# EAGLE design CrackberryPi_1.0.5 (EAGLE 7.2.0)
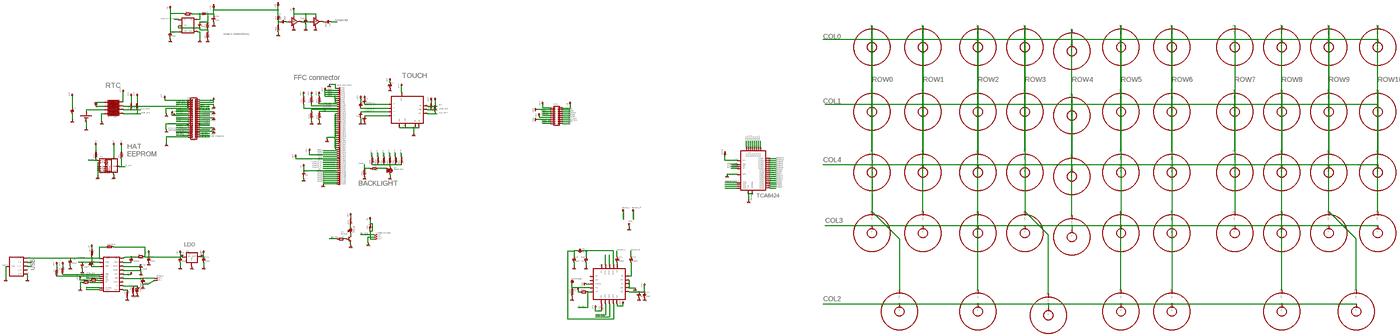
[diagram p0: schematic, sheet 1, overview]
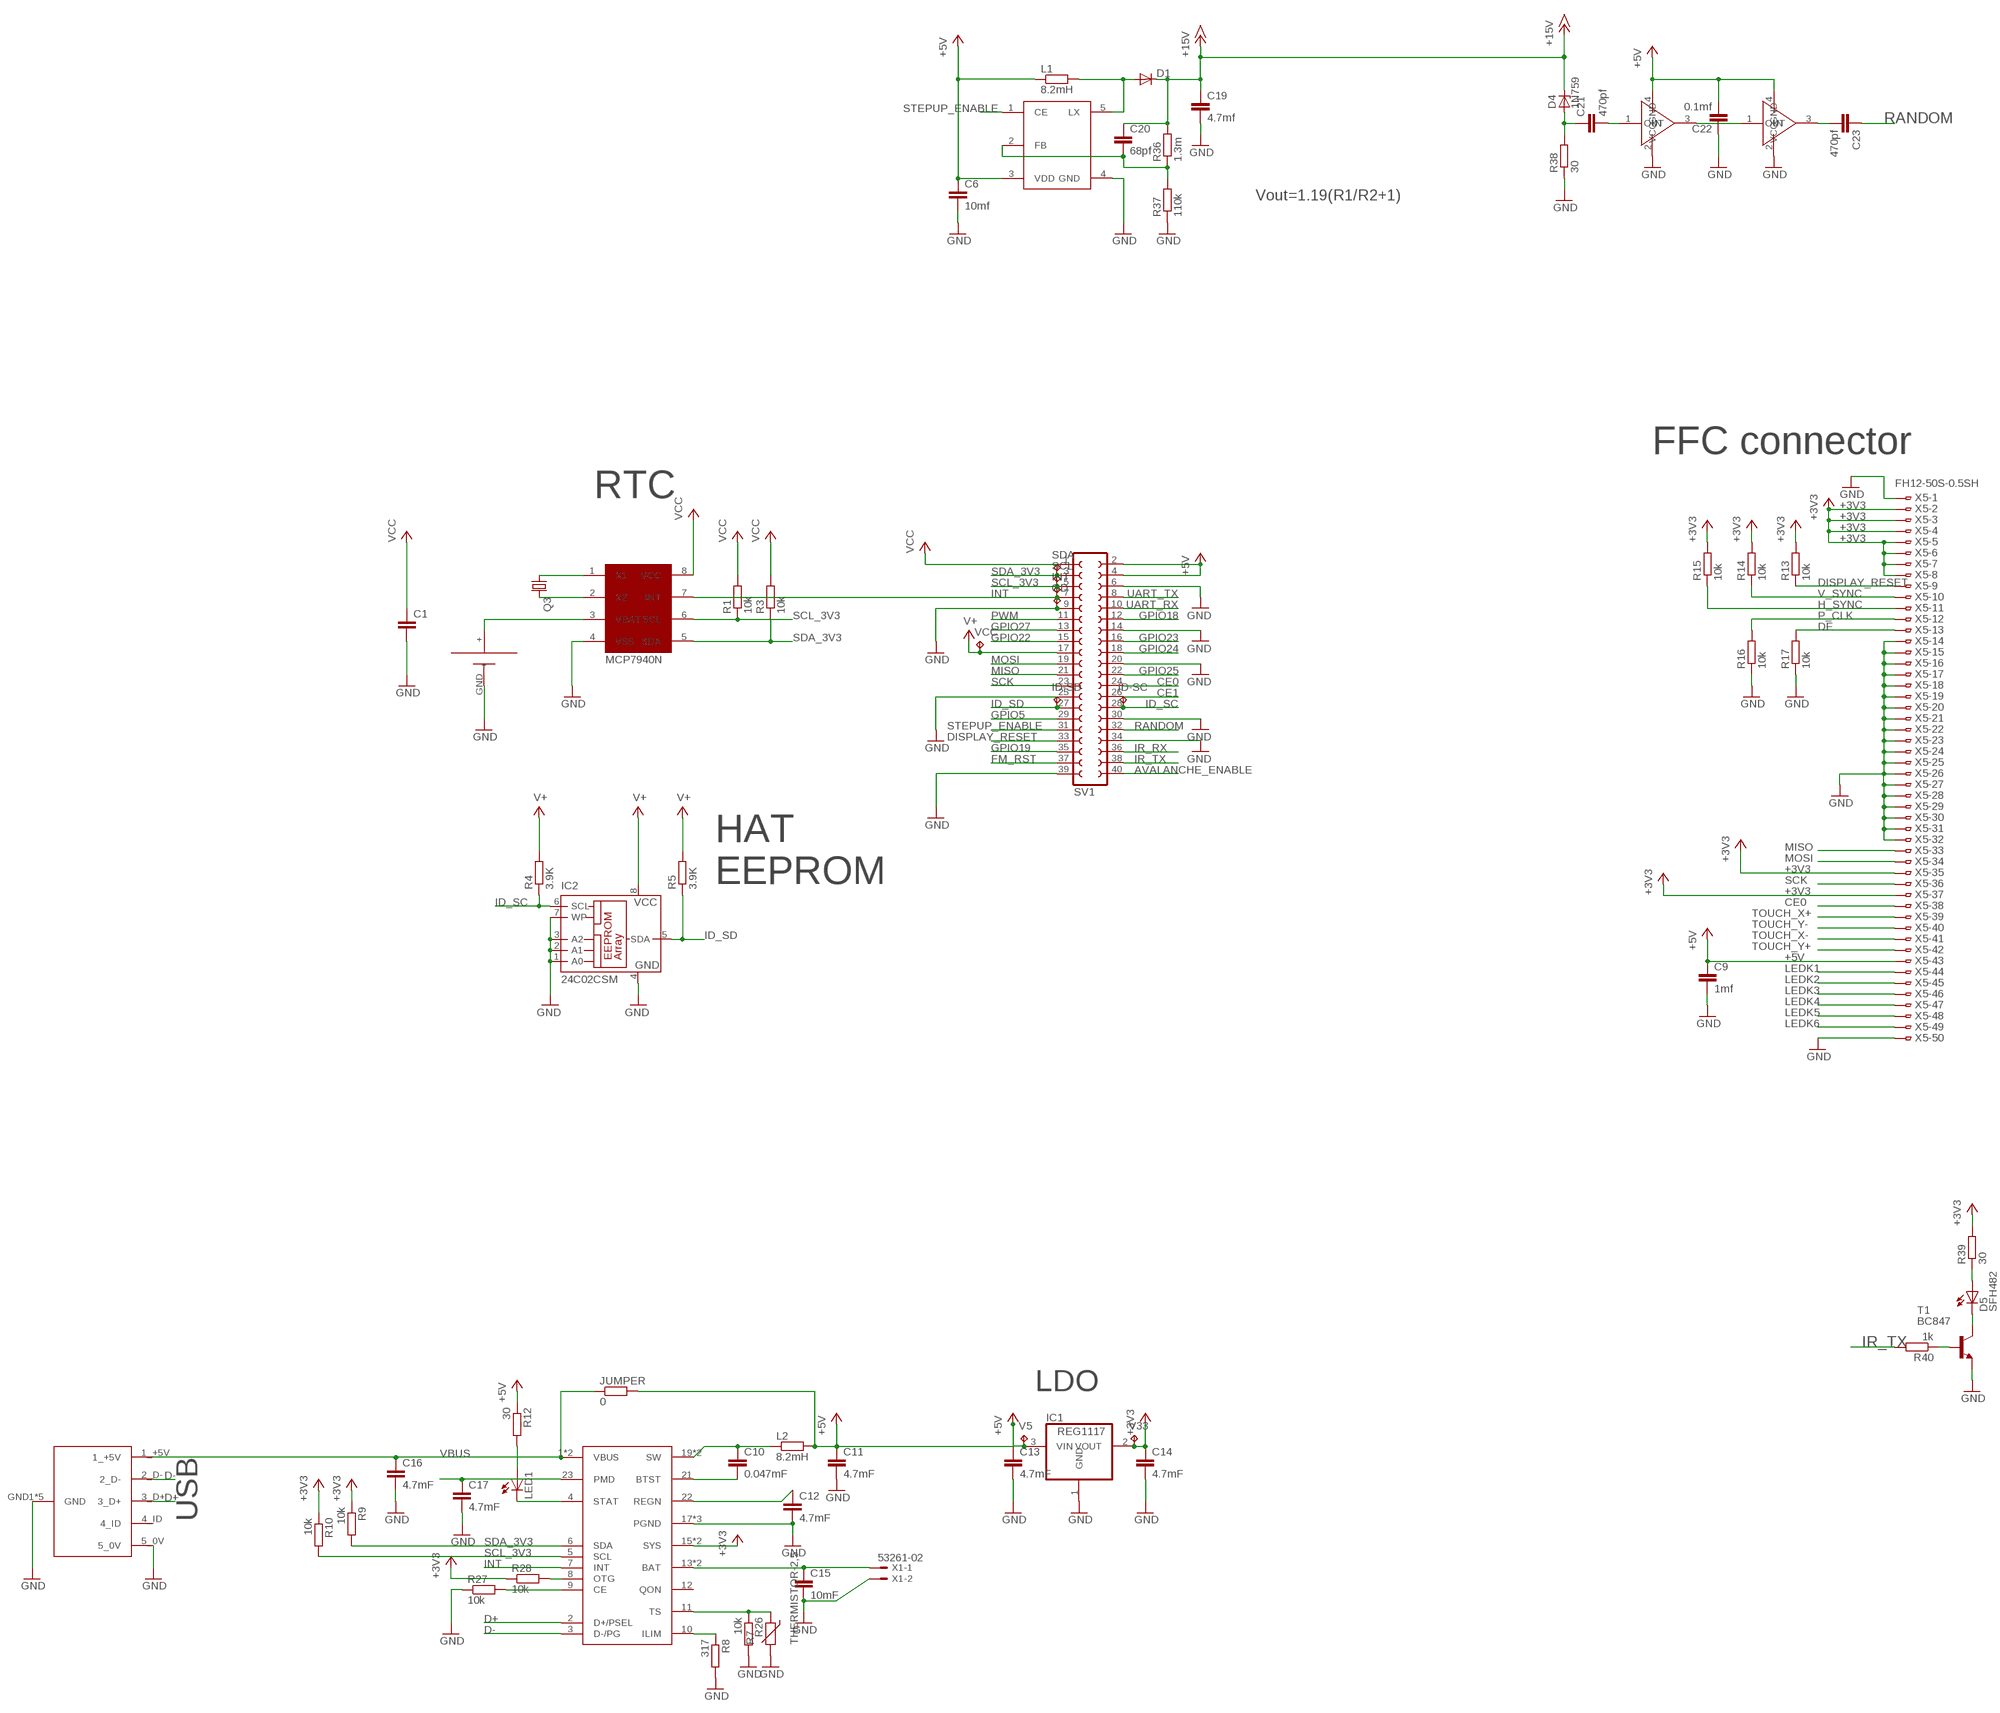
[diagram p1: schematic, sheet 1, part 1 of 4]
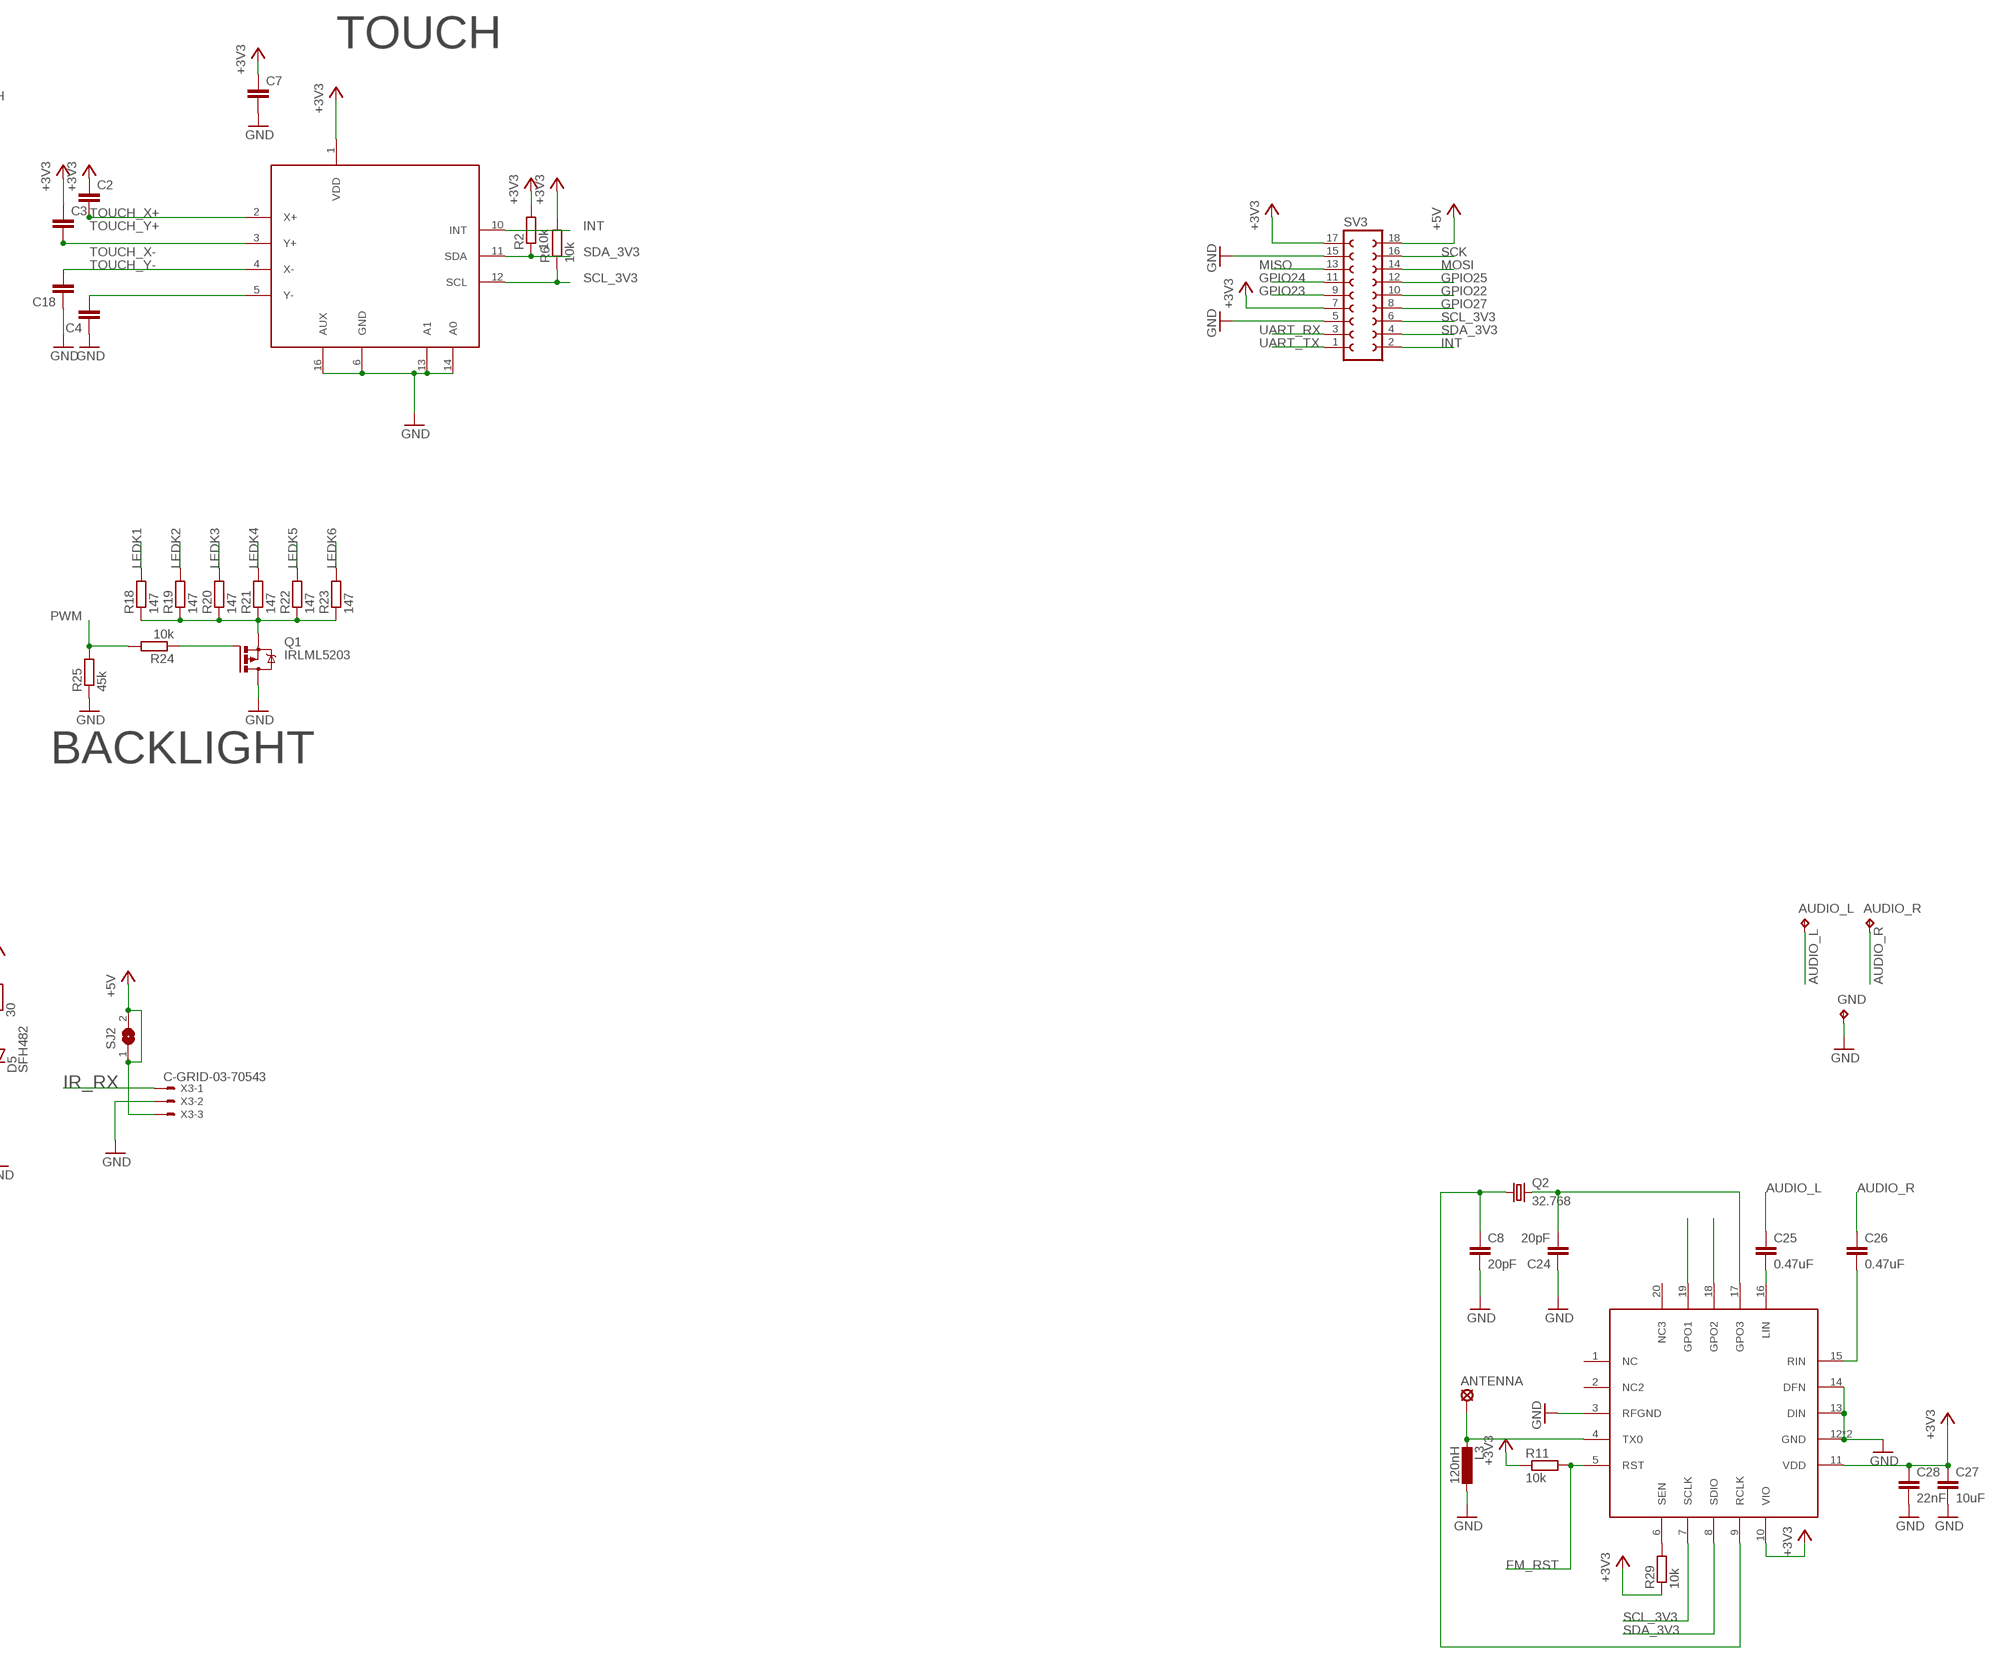
[diagram p2: schematic, sheet 1, part 2 of 4]
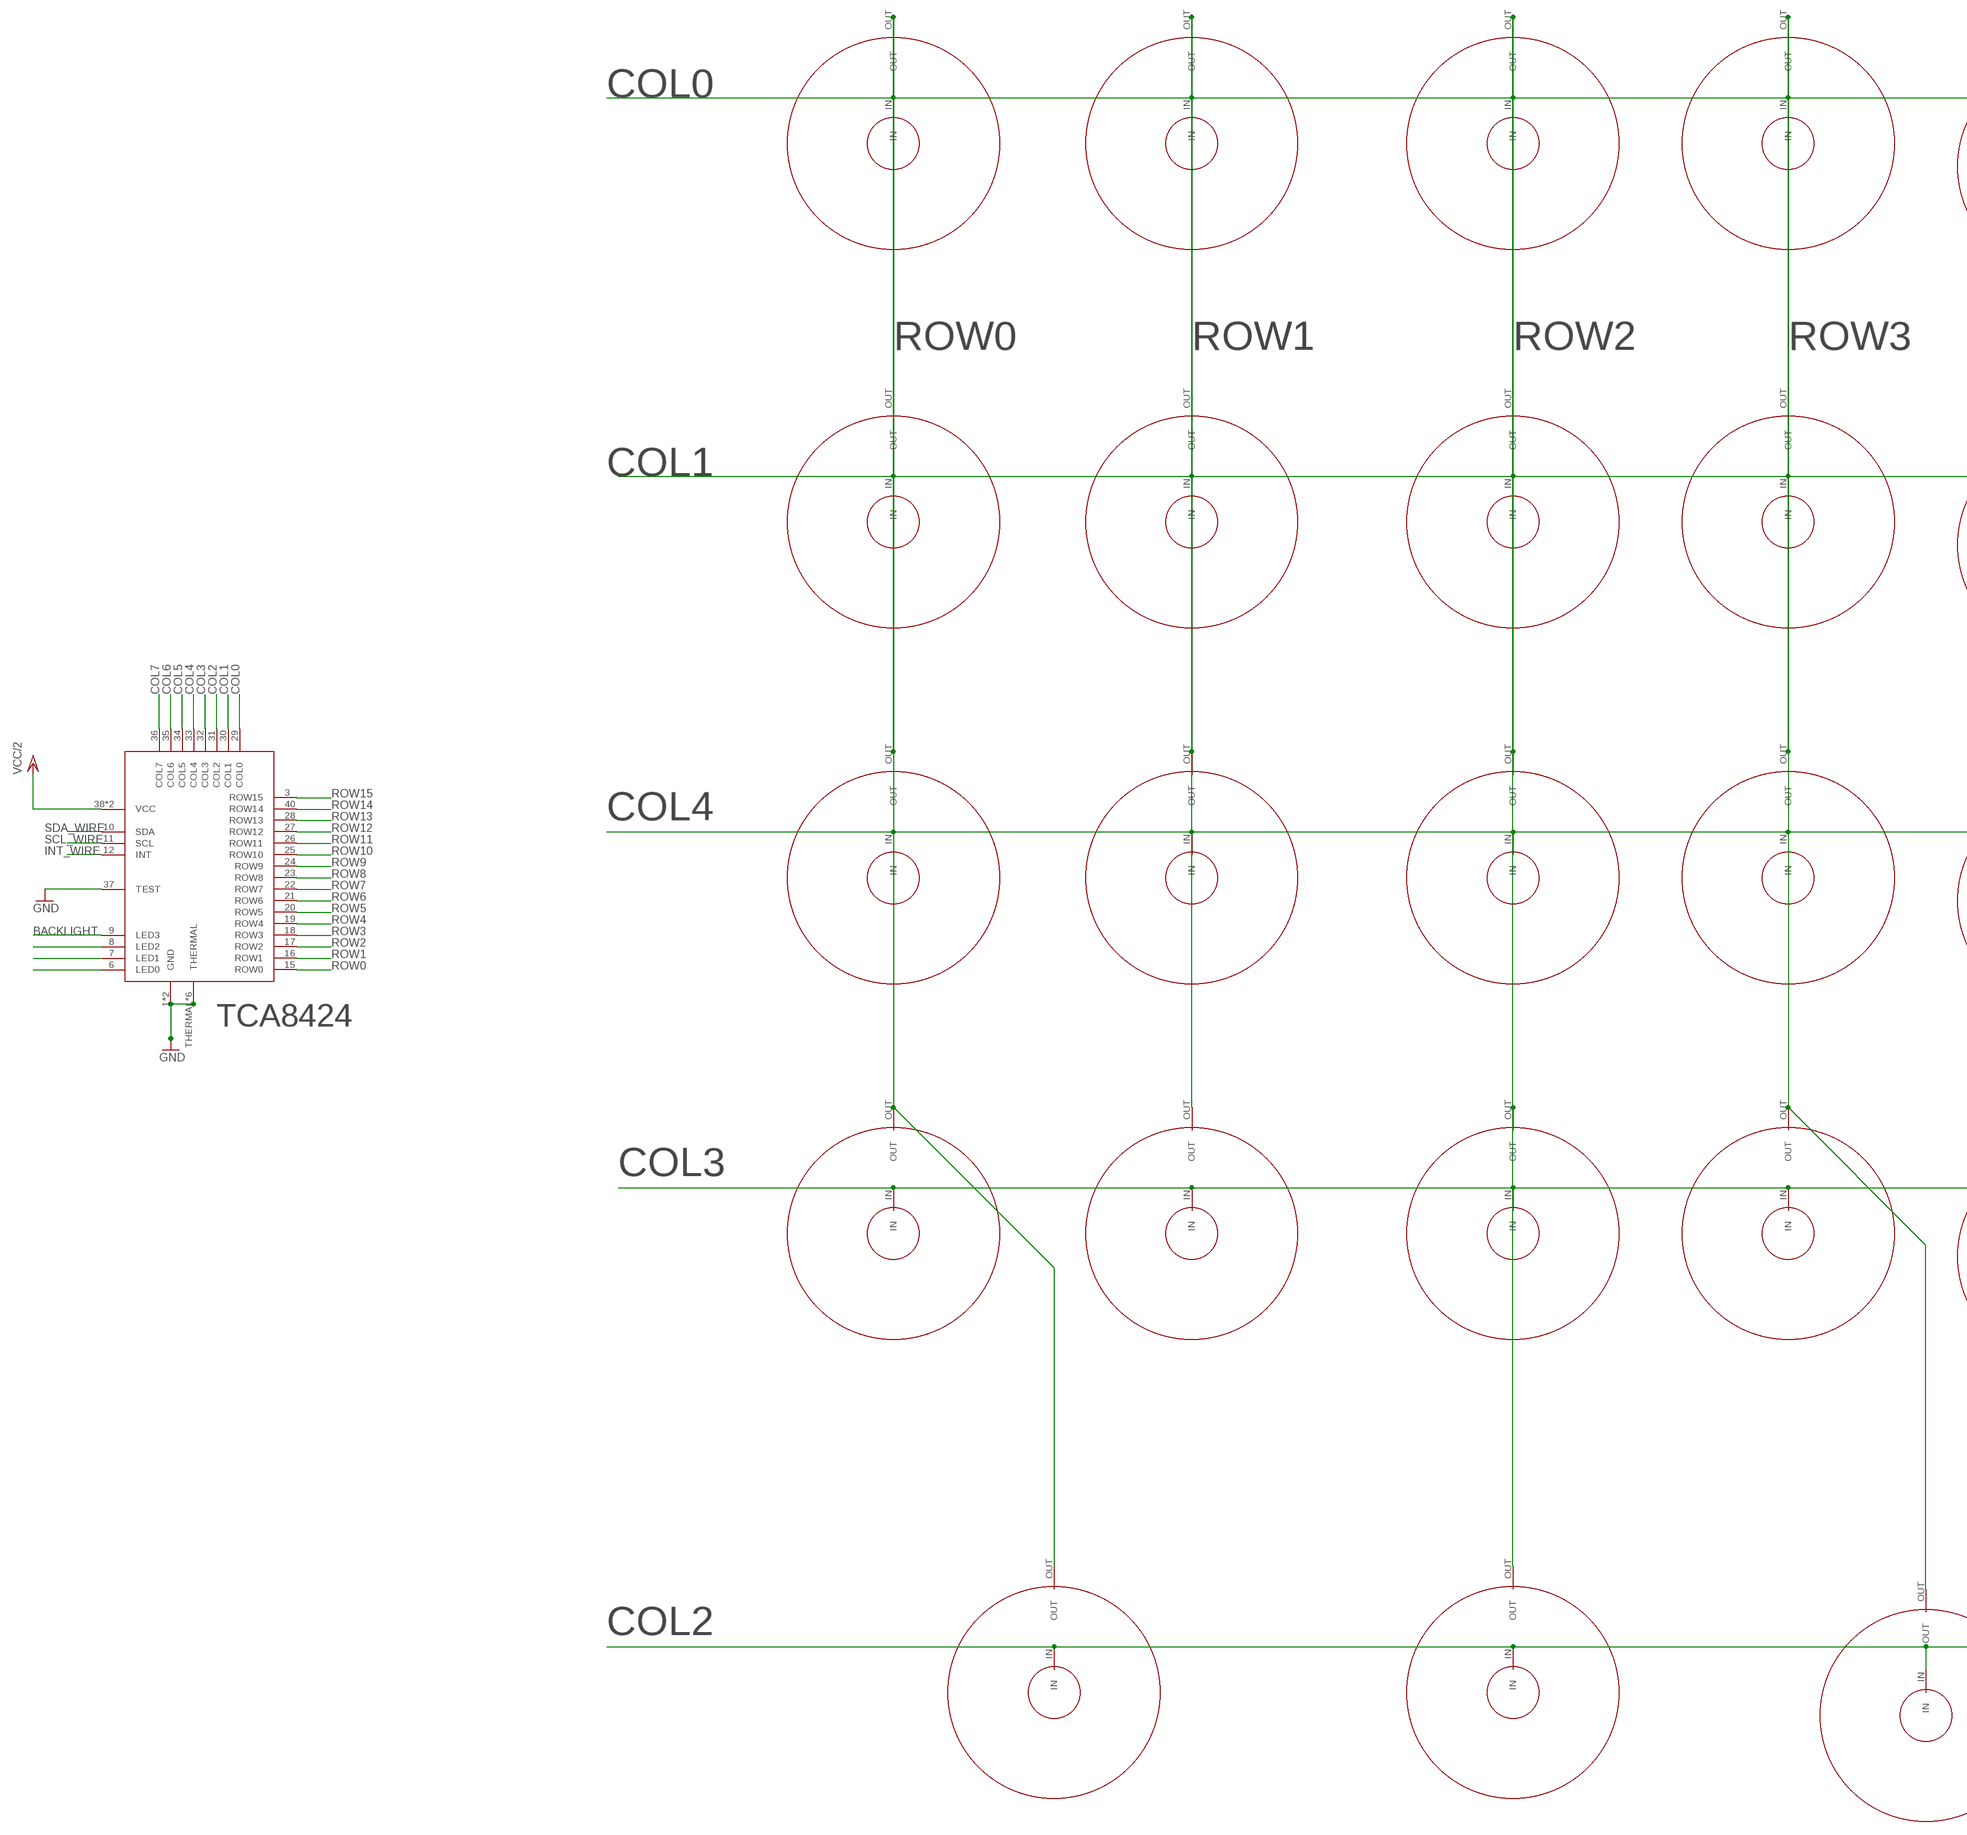
[diagram p3: schematic, sheet 1, part 3 of 4]
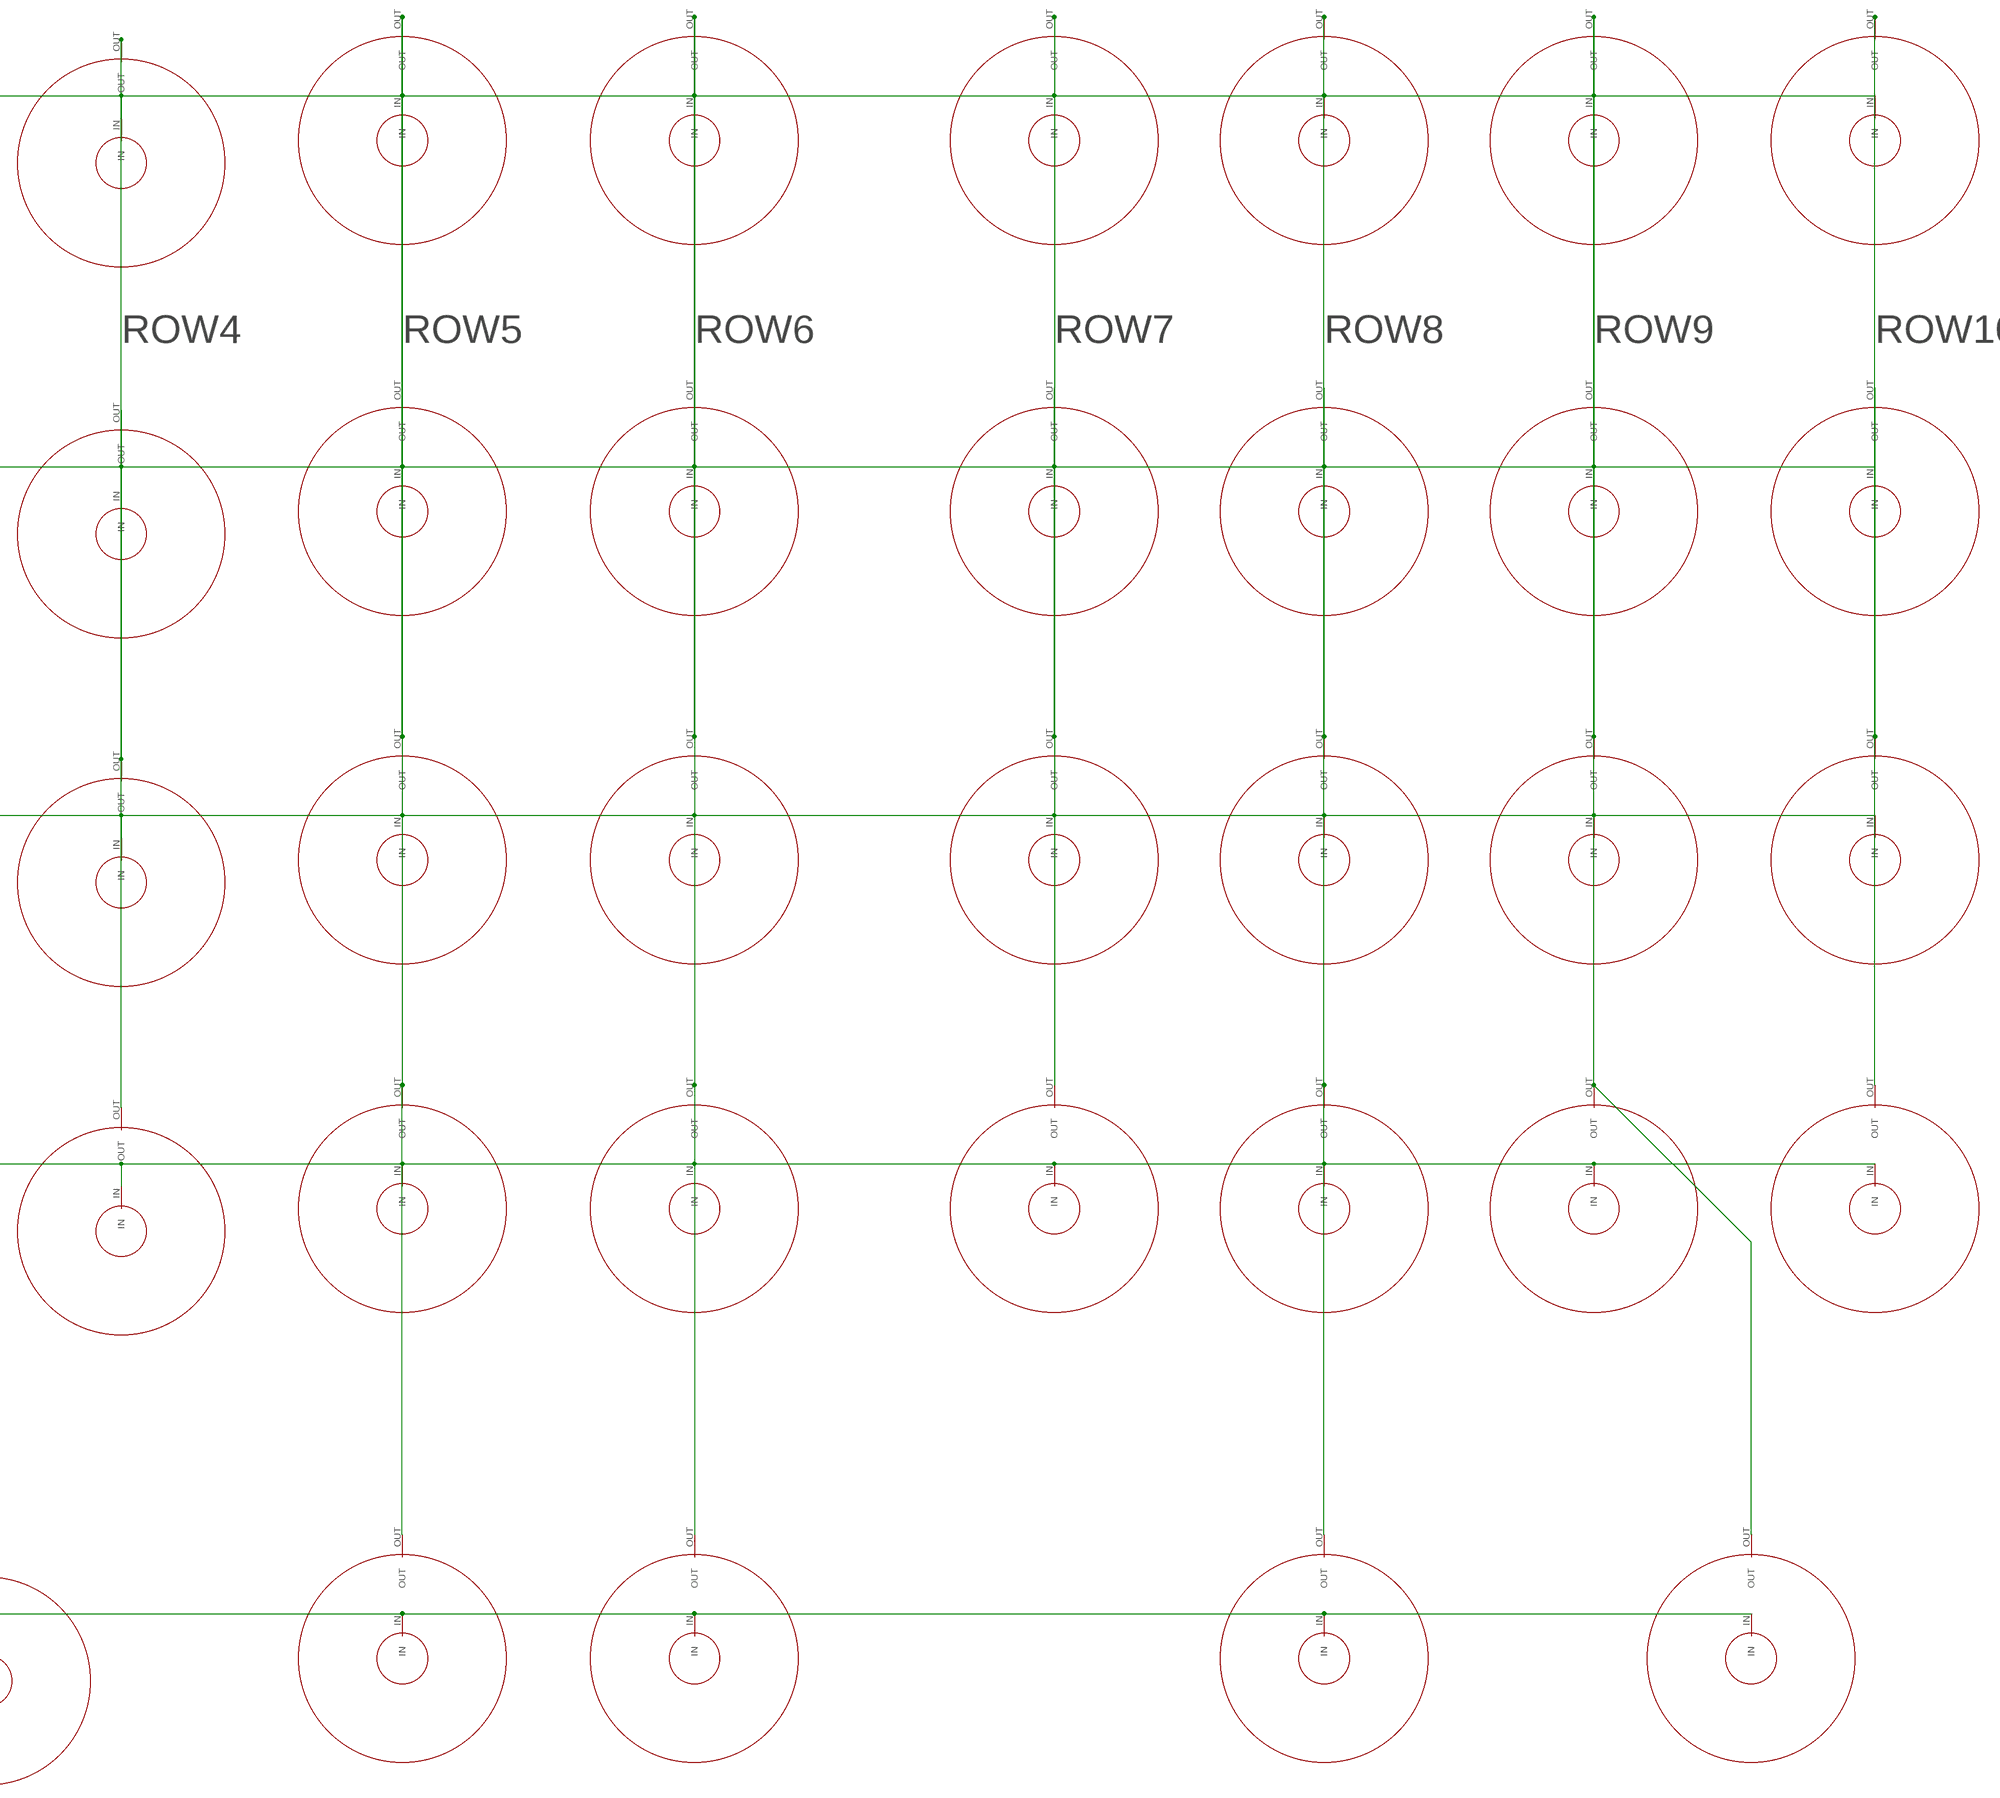
[diagram p4: schematic, sheet 1, part 4 of 4]

## Parts
0  DOME  [4MM]
1  DOME  [4MM]
2  DOME  [4MM]
3  DOME  [4MM]
4  DOME  [4MM]
5  DOME  [4MM]
6  DOME  [4MM]
7  DOME  [4MM]
8  DOME  [4MM]
9  DOME  [4MM]
!  DOME  [4MM]
(  DOME  [4MM]
)  DOME  [4MM]
+  DOME  [4MM]
,  DOME  [4MM]
-  DOME  [4MM]
.  DOME  [4MM]
?  DOME  [4MM]
@  DOME  [4MM]
A  DOME  [4MM]
ANTENNA  LSP10  [LSP10]
AUDIO_L  TPB2,54  [B2,54]
AUDIO_R  TPB2,54  [B2,54]
B  DOME  [4MM]
C  DOME  [4MM]
C1  C-EUC0603  [C0603]
C2  C-EUC0603  [C0603]
C3  C-EUC0603  [C0603]
C4  C-EUC0603  [C0603]
C6  10mf  C-EUC0603  [C0603]
C7  C-EUC0603  [C0603]
C8  20pF  C-EUC0603  [C0603]
C9  1mf  C-EUC0603  [C0603]
C10  0.047mF  C-EUC0402  [C0402]
C11  4.7mF  C-EUC0603  [C0603]
C12  4.7mF  C-EUC0603  [C0603]
C13  4.7mF  C-EUC0603  [C0603]
C14  4.7mF  C-EUC0603  [C0603]
C15  10mF  C-EUC1206  [C1206]
C16  4.7mF  C-EUC0603  [C0603]
C17  4.7mF  C-EUC0603  [C0603]
C18  C-EUC0603  [C0603]
C19  4.7mf  C-EUC0603  [C0603]
C20  68pf  C-EUC0603  [C0603]
C21  470pf  C-EUC0603  [C0603]
C22  0.1mf  C-EUC0603  [C0603]
C23  470pf  C-EUC0603  [C0603]
C24  20pF  C-EUC0603  [C0603]
C25  0.47uF  C-EUC0603  [C0603]
C26  0.47uF  C-EUC0603  [C0603]
C27  10uF  C-EUC0603  [C0603]
C28  22nF  C-EUC0603  [C0603]
D  DOME  [4MM]
D1  DIODE-SOD123  [SOD123]
D4  1N759  ZENER-DIODESOD80C  [SOD80C]
D5  SFH482  [SFH482]
E  DOME  [4MM]
F  DOME  [4MM]
FN-RIGHT  DOME  [4MM]
G  DOME  [4MM]
GD  TPB1,27  [B1,27]
GND  TPB2,54  [B2,54]
H  DOME  [4MM]
I  DOME  [4MM]
IC1  REG1117  [SOT223]
IC2  24C02CSM  [SO-08M]
ID-SC  TPB1,27  [B1,27]
ID-SD  TPB1,27  [B1,27]
INT  TPB1,27  [B1,27]
J  DOME  [4MM]
JUMPER  0  R-EU_R1206  [R1206]
K  DOME  [4MM]
L  DOME  [4MM]
L1  8.2mH  R-EU_R0805  [R0805]
L2  8.2mH  R-EU_R1206W  [R1206W]
L3  120nH  L-EUL2012C  [L2012C]
LED1  LEDSML0603  [SML0603]
M  DOME  [4MM]
N  DOME  [4MM]
O  DOME  [4MM]
P  DOME  [4MM]
Q  DOME  [4MM]
Q1  IRLML5203  [MICRO3]
Q2  32.768  CRYSTALMM20SS  [MM20SS]
Q3  CRYSTALMM20SS  [MM20SS]
R  DOME  [4MM]
R1  10k  R-EU_R0603  [R0603]
R2  10k  R-EU_R0603  [R0603]
R3  10k  R-EU_R0603  [R0603]
R4  3.9K  R-EU_R0603  [R0603]
R5  3.9K  R-EU_R0603  [R0603]
R6  10k  R-EU_R0603  [R0603]
R7  THERMISTOR-2,5  [RS-2,5]
R8  317  R-EU_R0603  [R0603]
R9  10k  R-EU_R0603  [R0603]
R10  10k  R-EU_R0603  [R0603]
R11  10k  R-EU_R0603  [R0603]
R12  30  R-EU_R0603  [R0603]
R13  10k  R-EU_R0603  [R0603]
R14  10k  R-EU_R0603  [R0603]
R15  10k  R-EU_R0603  [R0603]
R16  10k  R-EU_R0603  [R0603]
R17  10k  R-EU_R0603  [R0603]
R18  147  R-EU_R0603  [R0603]
R19  147  R-EU_R0603  [R0603]
R20  147  R-EU_R0603  [R0603]
R21  147  R-EU_R0603  [R0603]
R22  147  R-EU_R0603  [R0603]
R23  147  R-EU_R0603  [R0603]
R24  10k  R-EU_R0603  [R0603]
R25  45k  R-EU_R0603  [R0603]
R26  10k  R-EU_R0603  [R0603]
R27  10k  R-EU_R0603  [R0603]
R28  10k  R-EU_R0603  [R0603]
R29  10k  R-EU_R0603  [R0603]
R36  1.3m  R-EU_R0603  [R0603]
R37  110k  R-EU_R0603  [R0603]
R38  30  R-EU_R0603  [R0603]
R39  30  R-EU_R0603  [R0603]
R40  1k  R-EU_R0603  [R0603]
S  DOME  [4MM]
SCL  TPB1,27  [B1,27]
SDA  TPB1,27  [B1,27]
SHIFT-RIGHT  DOME  [4MM]
SHILFT-LEFT  DOME  [4MM]
SJ2  SJ  [SJ]
SPACE1  DOME  [4MM]
SPACE2  DOME  [4MM]
SPACE3  DOME  [4MM]
SV1  FE20-2  [FE20-2]
SV3  FE09-2  [FE09-2]
T  DOME  [4MM]
T1  BC847  [SOT23]
U  DOME  [4MM]
U$1  BQ24297  [VQFN-4X4-24]
U$2  NCP1406  [SOT23-5L]
U$3  MAX2650  [SOT143-W]
U$4  CR1216  [CR1216]
U$5  MCP7940N  [SO08]
U$6  TSC2007  [TSSOP16]
U$7  TCA8424  [QFN40]
U$8  SI4713  [QFN20-3X3]
U$9  MICRO_USB  [MICRO_USB]
U$10  MAX2650  [SOT143-W]
V  DOME  [4MM]
V5  TPB1,27  [B1,27]
V33  TPB1,27  [B1,27]
VCC  TPB1,27  [B1,27]
W  DOME  [4MM]
X  DOME  [4MM]
X1  53261-02  [53261-02]
X3  C-GRID-03-70543  [70543-03]
X5  FH12-50S-0.5SH  [FH12-50S-0.5SH]
Y  DOME  [4MM]
Z  DOME  [4MM]

## Nets
+3V3: C2.1 C3.1 C7.1 C14.1 C27.1 C28.1 IC1.2(VOUT) R2.2 R6.2 R9.1 R10.1 R11.1 R13.2 R14.2 R15.2 R28.1 R29.1 R39.2 SV3.7 SV3.17 U$1.15(SYS) U$1.16(SYS) U$6.1(VDD) U$8.10(VIO) U$8.11(VDD) V33.TP X5.2 X5.3 X5.4 X5.5 X5.6 X5.7 X5.8 X5.35 X5.37
+5V: C6.1 C9.1 C11.1 C13.1 C22.2 IC1.3(VIN) JUMPER.2 L1.1 L2.2 R12.1 SJ2.1 SJ2.2 SV1.2 SV1.4 SV3.18 U$2.3(VDD) U$3.4(VCC) U$10.4(VCC) V5.TP X3.3 X5.43
+15V: C19.1 C20.1 D1.C D4.C R36.2
AUDIO_L: AUDIO_L.TP C25.1
AUDIO_R: AUDIO_R.TP C26.1
AVALANCHE_ENABLE: SV1.40
BACKLIGHT: U$7.9(LED3)
BASE: R40.1 T1.1(B)
CE0: SV1.24 X5.38
CE1: SV1.26
COL0: 0.IN 1.IN 2.IN 3.IN 4.IN 5.IN 6.IN 7.IN 8.IN 9.IN -.IN U$7.29(COL0)
COL1: +.IN E.IN I.IN O.IN P.IN Q.IN R.IN T.IN U$7.30(COL1) U.IN W.IN Y.IN
COL2: @.IN FN-RIGHT.IN SHIFT-RIGHT.IN SHILFT-LEFT.IN SPACE1.IN SPACE2.IN SPACE3.IN U$7.31(COL2)
COL3: !.IN ,.IN ..IN ?.IN B.IN C.IN M.IN N.IN U$7.32(COL3) V.IN X.IN Z.IN
COL4: (.IN ).IN A.IN D.IN F.IN G.IN H.IN J.IN K.IN L.IN S.IN U$7.33(COL4)
COL5: U$7.34(COL5)
COL6: U$7.35(COL6)
COL7: U$7.36(COL7)
COLLECTOR: D5.K(C) T1.3(C)
D+: U$1.2(D+/PSEL) U$9.3_D+
D-: U$1.3(D-/PG) U$9.2_D-
DE: R17.2 X5.13
DISPLAY_RESET: R13.1 SV1.33 X5.9
EMITTER: T1.2(E) ; supply symbol labelled GND
FB: C20.2 R36.1 R37.2 U$2.2(FB)
FM_RST: R11.2 SV1.37 U$8.5(RST)
GND: C1.2 C4.1 C6.2 C7.2 C8.2 C9.2 C11.2 C12.2 C13.2 C14.2 C15.2 C16.2 C17.2 C18.1 C19.2 C22.1 C24.1 C27.2 C28.2 GD.TP GND.TP IC1.1(GND) IC2.1(A0) IC2.2(A1) IC2.3(A2) IC2.4(GND) IC2.7(WP) L3.1 Q1.3(D) R7.2 R8.2 R16.1 R17.1 R25.1 R26.2 R27.1 R37.1 R38.1 SV1.6 SV1.9 SV1.14 SV1.20 SV1.25 SV1.30 SV1.34 SV1.39 SV3.5 SV3.15 U$1.17(PGND) U$1.18(PGND) U$1.P$1(PGND) U$2.4(GND) U$3.2(GND) U$4.GND(-) U$5.4(VSS) U$6.6(GND) U$6.13(A1) U$6.14(A0) U$6.16(AUX) U$7.1(GND) U$7.4(GND) U$7.37(TEST) U$7.THERMAL U$7.VIA1(THERMAL) U$7.VIA2(THERMAL) U$7.VIA3(THERMAL) U$7.VIA4(THERMAL) U$7.VIA5(THERMAL) U$8.3(RFGND) U$8.12(GND) U$8.13(DIN) U$8.14(DFN) U$8.P$1(GND) U$9.5_0V U$9.GND1(GND) U$9.GND2(GND) U$9.GND5(GND) U$9.P$1(GND) U$9.P$7(GND) U$10.2(GND) X1.2 X3.2 X5.1 X5.14 X5.15 X5.16 X5.17 X5.18 X5.19 X5.20 X5.21 X5.22 X5.23 X5.24 X5.25 X5.26 X5.27 X5.28 X5.29 X5.30 X5.31 X5.32 X5.50
GPIO5: SV1.29
GPIO18: SV1.12
GPIO19: SV1.35
GPIO22: SV1.15 SV3.10
GPIO23: SV1.16 SV3.9
GPIO24: SV1.18 SV3.11
GPIO25: SV1.22 SV3.12
GPIO27: SV1.13 SV3.8
GPO1: U$8.19(GPO1)
GPO2: U$8.18(GPO2)
H_SYNC: R15.1 X5.11
ID_SC: IC2.6(SCL) ID-SC.TP R4.1 SV1.28
ID_SD: IC2.5(SDA) ID-SD.TP R5.1 SV1.27
IN_1: C21.2 U$3.1(IN)
INT: INT.TP SV1.7 SV3.2 U$1.7(INT) U$5.7(INT) U$6.10(INT)
INT_WIRE: U$7.12(INT)
IR_RX: SV1.36 X3.1
IR_TX: R40.2 SV1.38
LEDK1: R18.2 X5.44
LEDK2: R19.2 X5.45
LEDK3: R20.2 X5.46
LEDK4: R21.2 X5.47
LEDK5: R22.2 X5.48
LEDK6: R23.2 X5.49
LX: D1.A L1.2 U$2.5(LX)
MISO: SV1.21 SV3.13 X5.33
MOSI: SV1.19 SV3.14 X5.34
N$1: C10.1 L2.1 U$1.19(SW) U$1.20(SW)
N$2: C10.2 U$1.21(BTST)
N$3: C15.1 U$1.13(BAT) U$1.14(BAT) X1.1
N$4: LED1.A R12.2
N$5: C12.1 U$1.22(REGN)
N$6: R7.1 R26.1 U$1.11(TS)
N$7: R8.1 U$1.10(ILIM)
N$8: C17.1 U$1.23(PMD)
N$9: LED1.C U$1.4(STAT)
N$10: U$7.6(LED0)
N$11: Q3.1 U$5.1(X1)
N$12: Q1.2(S) R18.1 R19.1 R20.1 R21.1 R22.1 R23.1
N$13: Q3.4 U$5.2(X2)
N$14: U$7.7(LED1)
N$15: R27.2 U$1.9(CE)
N$16: C21.1 D4.A R38.2
N$17: R28.2 U$1.8(OTG)
N$18: U$7.8(LED2)
N$19: C24.2 Q2.4 U$8.17(GPO3)
N$20: Q1.1(G) R24.1
N$21: C8.1 Q2.1 U$8.9(RCLK)
N$22: C25.2 U$8.16(LIN)
N$23: C26.2 U$8.15(RIN)
N$25: ANTENNA.MP L3.2 U$8.4(TX0)
N$26: R29.2 U$8.6(SEN)
N$30: D5.A R39.1
OUT1_IN2: U$3.3(OUT) U$10.1(IN)
OUT2: C23.2 U$10.3(OUT)
P_CLK: R16.2 X5.12
PWM: R24.2 R25.2 SV1.11
RANDOM: C23.1 SV1.32
ROW0: 1.OUT A.OUT Q.OUT SHILFT-LEFT.OUT U$7.15(ROW0) Z.OUT
ROW1: 2.OUT S.OUT U$7.16(ROW1) W.OUT X.OUT
ROW2: 3.OUT C.OUT D.OUT E.OUT SPACE1.OUT U$7.17(ROW2)
ROW3: 4.OUT F.OUT R.OUT SPACE2.OUT U$7.18(ROW3) V.OUT
ROW4: 5.OUT B.OUT G.OUT T.OUT U$7.19(ROW4)
ROW5: 6.OUT H.OUT N.OUT SPACE3.OUT U$7.20(ROW5) Y.OUT
ROW6: 7.OUT J.OUT M.OUT SHIFT-RIGHT.OUT U$7.21(ROW6) U.OUT
ROW7: 8.OUT ?.OUT I.OUT K.OUT U$7.22(ROW7)
ROW8: 9.OUT !.OUT @.OUT L.OUT O.OUT U$7.23(ROW8)
ROW9: 0.OUT (.OUT ,.OUT FN-RIGHT.OUT P.OUT U$7.24(ROW9)
ROW10: ).OUT +.OUT -.OUT ..OUT U$7.25(ROW10)
ROW11: U$7.26(ROW11)
ROW12: U$7.27(ROW12)
ROW13: U$7.28(ROW13)
ROW14: U$7.40(ROW14)
ROW15: U$7.3(ROW15)
SCK: SV1.23 SV3.16 X5.36
SCL_3V3: R1.1 R6.1 R10.2 SCL.TP SV1.5 SV3.6 U$1.5(SCL) U$5.6(SCL) U$6.12(SCL) U$8.7(SCLK)
SCL_WIRE: U$7.11(SCL)
SDA_3V3: R2.1 R3.1 R9.2 SDA.TP SV1.3 SV3.4 U$1.6(SDA) U$5.5(SDA) U$6.11(SDA) U$8.8(SDIO)
SDA_WIRE: U$7.10(SDA)
STEPUP_ENABLE: SV1.31 U$2.1(CE)
TOUCH_X+: C2.2 U$6.2(X+) X5.39
TOUCH_X-: C18.2 U$6.4(X-) X5.41
TOUCH_Y+: C3.2 U$6.3(Y+) X5.42
TOUCH_Y-: C4.2 U$6.5(Y-) X5.40
UART_RX: SV1.10 SV3.3
UART_TX: SV1.8 SV3.1
V+: IC2.8(VCC) R4.2 R5.2 SV1.17 VCC.TP
V_SYNC: R14.1 X5.10
VBAT+: U$4.+ U$5.3(VBAT)
VBUS: C16.1 JUMPER.1 U$1.1(VBUS) U$1.24(VBUS) U$9.1_+5V
VCC: C1.1 R1.2 R3.2 SV1.1 U$5.8(VCC)
VCC/2: U$7.38(VCC) U$7.39(VCC)
Unconnected: U$1.12(QON) U$8.1(NC) U$8.2(NC2) U$8.20(NC3) U$9.4_ID

## Notes on the sheet
- Vout=1.19(R1/R2+1)
- FFC connector | TOUCH
- RTC
- MCP7940N
- HAT
  EEPROM
- BACKLIGHT
- TCA8424
- LDO
- USB

## Library data of the parts
0 1-9 ! ( ) + , - . ? @ A B C D E F FN-RIGHT G H I J K L M N O P Q R S SHIFT-RIGHT SHILFT-LEFT SPACE1-SPACE3 T U V W X Y Z = DOME:DOME
ANTENNA = solpad:LSP10: SOLDER PAD drill 1.0 mm, distributor Buerklin, 12H555
AUDIO_L AUDIO_R GD GND ID-SC ID-SD INT SCL SDA V5 V33 VCC = testpad:TP: Test pad
C1-C4 C6-C28 = rcl:C-EU: CAPACITOR, European symbol
D1 = diode:DIODE-: DIODE
D4 = diode:ZENER-DIODE: Z-Diode
D5 = led:SFH482: IR LED infrared emitting diode, Infineon
IC1 = burr-brown:REG1117: 800mA and 1A Low Dropout (LDO) Positive Regulator 1.8V, 2.5V, 2.85V, 3.3V, 5V, and Adj; MPN: REG1117; OC_FARNELL: 1097566; OC_NEWARK: 14P6981
IC2 = microchip:24C*: Serial EEPROM 1 K/2 K/4 K; MF: MICROCHIP; MPN: 24C02C-I/SN; OC_FARNELL: 1084339; OC_NEWARK: 96K4063
JUMPER L1 L2 R1-R6 R8-R29 R36-R40 = rcl:R-EU_: RESISTOR, European symbol
L3 = rcl:L-EU: INDUCTOR, European symbol
LED1 = led:LED: LED OSRAM: - CHIPLED LG R971, LG N971, LY N971, LG Q971, LY Q971, LO R971, LY R971 LH N974, LH R974 LS Q976, LO Q976, LY Q976 LO Q996 - Hyper CHIPLED LW Q18S LB Q993, LB Q99A, LB R99A - SideLED LS A670, LO A670, LY A670, LG A670, LP A670 LB A673, LV A673, LT A673, LW A673 LH A674 LY A675 LS A676, LA A676, LO A676, LY A676, LW A676 LS A679, LY A679, LG A679 - Hyper Micro SIDELED® LS Y876, LA Y876, LO Y876, LY Y876 LT Y87S - SmartLED LW L88C, LW L88S LB L89C, LB L89S, LG L890 LS L89K, LO L89K, LY L89K LS L896, LA L896, LO L896, LY L896 - TOPLED LS T670, LO T670, LY T670, LG T670, LP T670 LSG T670, LSP T670, LSY T670, LOP T670, LYG T670 LG T671, LOG T671, LSG T671 LB T673, LV T673, LT T673, LW T673 LH T674 LS T676, LA T676, LO T676, LY T676, LB T676, LH T676, LSB T676, LW T676 LB T67C, LV T67C, LT T67C, LS T67K, LO T67K, LY T67K, LW E67C LS E67B, LA E67B, LO E67B, LY E67B, LB E67C, LV E67C, LT E67C LW T67C LS T679, LY T679, LG T679 LS T770, LO T770, LY T770, LG T770, LP T770 LB T773, LV T773, LT T773, LW T773 LH T774 LS E675, LA E675, LY E675, LS T675 LS T776, LA T776, LO T776, LY T776, LB T776 LHGB T686 LT T68C, LB T68C - Hyper Mini TOPLED® LB M676 - Mini TOPLED Santana® LG M470 LS M47K, LO M47K, LY M47K Source: http://www.osram.convergy.de LUXEON: - LUMILED® LXK2-PW12-R00, LXK2-PW12-S00, LXK2-PW14-U00, LXK2-PW14-V00 LXK2-PM12-R00, LXK2-PM12-S00, LXK2-PM14-U00 LXK2-PE12-Q00, LXK2-PE12-R00, LXK2-PE12-S00, LXK2-PE14-T00, LXK2-PE14-U00 LXK2-PB12-K00, LXK2-PB12-L00, LXK2-PB12-M00, LXK2-PB14-N00, LXK2-PB14-P00, LXK2-PB14-Q00 LXK2-PR12-L00, LXK2-PR12-M00, LXK2-PR14-Q00, LXK2-PR14-R00 LXK2-PD12-Q00, LXK2-PD12-R00, LXK2-PD12-S00 LXK2-PH12-R00, LXK2-PH12-S00 LXK2-PL12-P00, LXK2-PL12-Q00, LXK2-PL12-R00 Source: www.luxeon.com KINGBRIGHT: KA-3528ASYC Source: www.kingbright.com
Q1 = transistor-power:IRLML5203: HEXFET P-Channel Power MOSFET
Q2 Q3 = crystal:CRYSTAL: CRYSTAL; OC_FARNELL: unknown; OC_NEWARK: unknown
R7 = varistor:THERMISTOR: THERMISTOR
SJ2 = jumper:SJ: SMD solder JUMPER
SV1 = con-lsta:FE20-2: FEMALE HEADER; OC_FARNELL: unknown; OC_NEWARK: unknown
SV3 = con-lsta:FE09-2: FEMALE HEADER; OC_FARNELL: unknown; OC_NEWARK: unknown
T1 = transistor:BC847: NPN TRANSISTOR
U$1 = BQ24297:BQ24297
U$2 = ncp1406:NCP1406
U$3 U$10 = max2650:MAX2650
U$4 = cr1216:CR1216
U$5 = MCP7940N:MCP7940N
U$6 = tsc2046:TSC2007
U$7 = TCA8424:TCA8424
U$8 = Si4713:SI4713
U$9 = MICRO_USB:MICRO_USB
X1 = con-molex:53?-02: CONNECTOR wire to board 1.25 mm (.049 inch) pitch header; OC_FARNELL: 1125373; OC_NEWARK: unknown
X3 = con-molex:C-GRID-03: CONNECTOR wire to board 2.54 mm (0.100") pitch header; OC_FARNELL: unknown; OC_NEWARK: unknown
X5 = FCI_62684:FH12-50S-0.5S: 0.5mm Pitch Connectors For FPC/FFC Source: Data sheet <http://www.hirose.co.jp/cataloge_hp/e58605370.pdf>; MPN: FH12-50S-0.5SH(55); OC_FARNELL: 1324557; OC_NEWARK: 34M6181

## Board
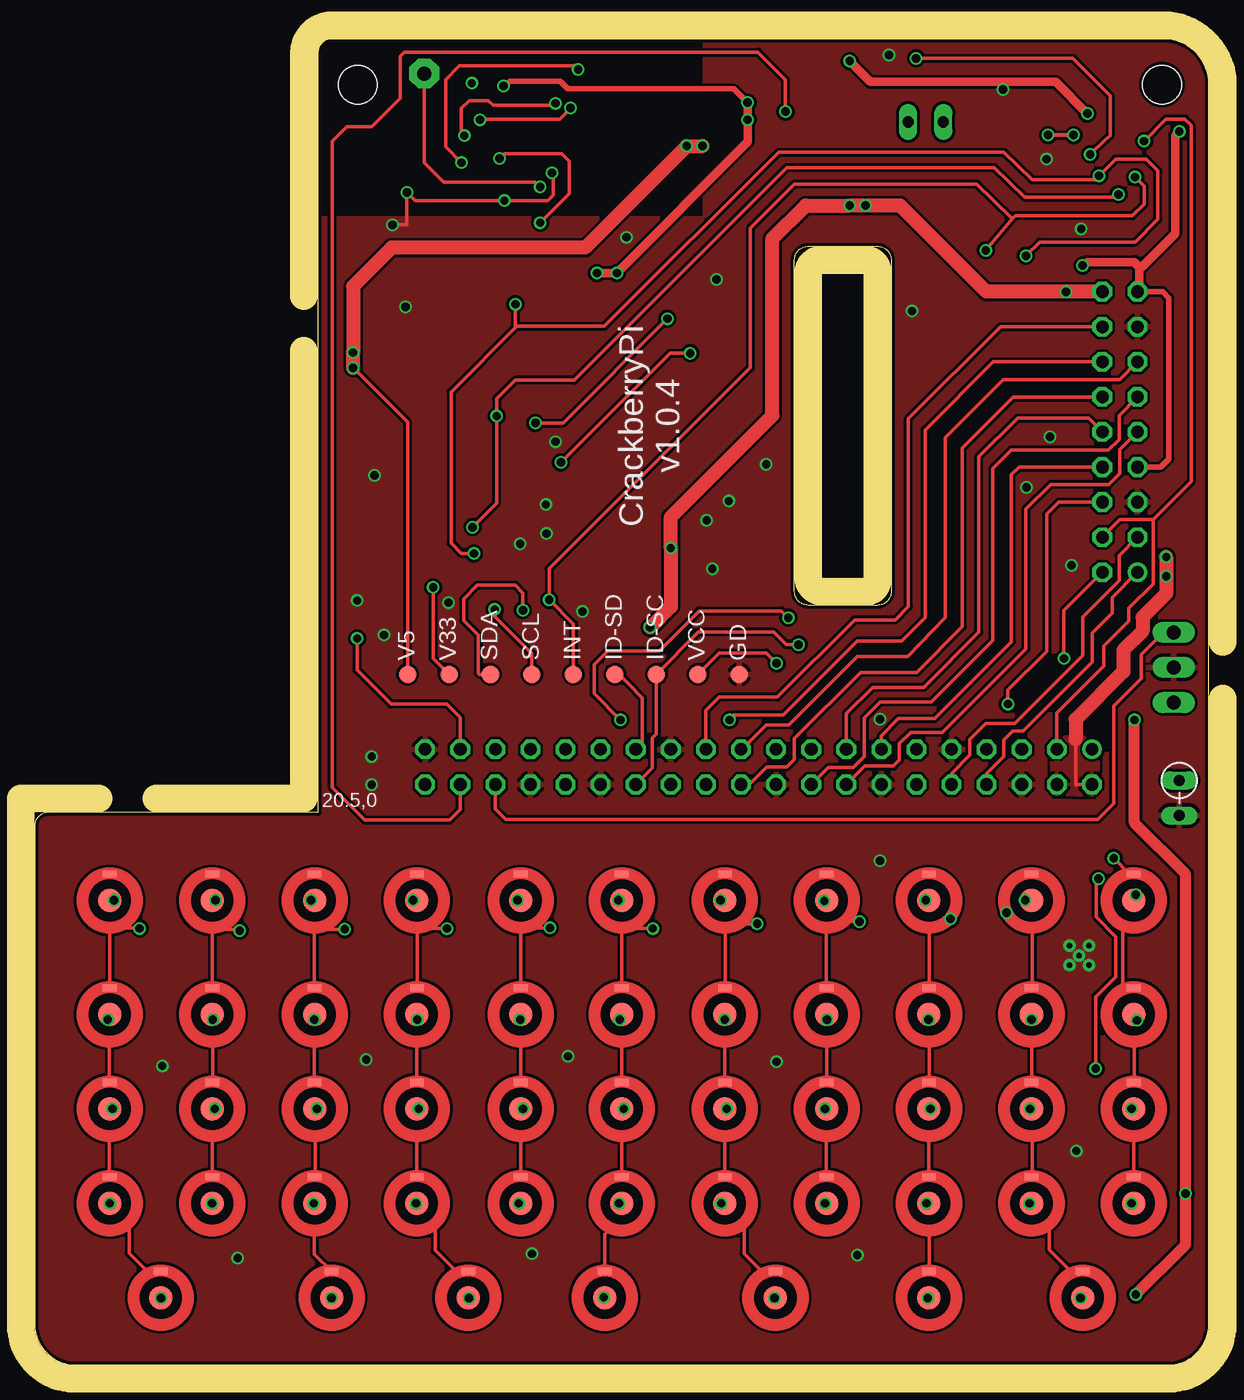
[diagram p5: board, top side]
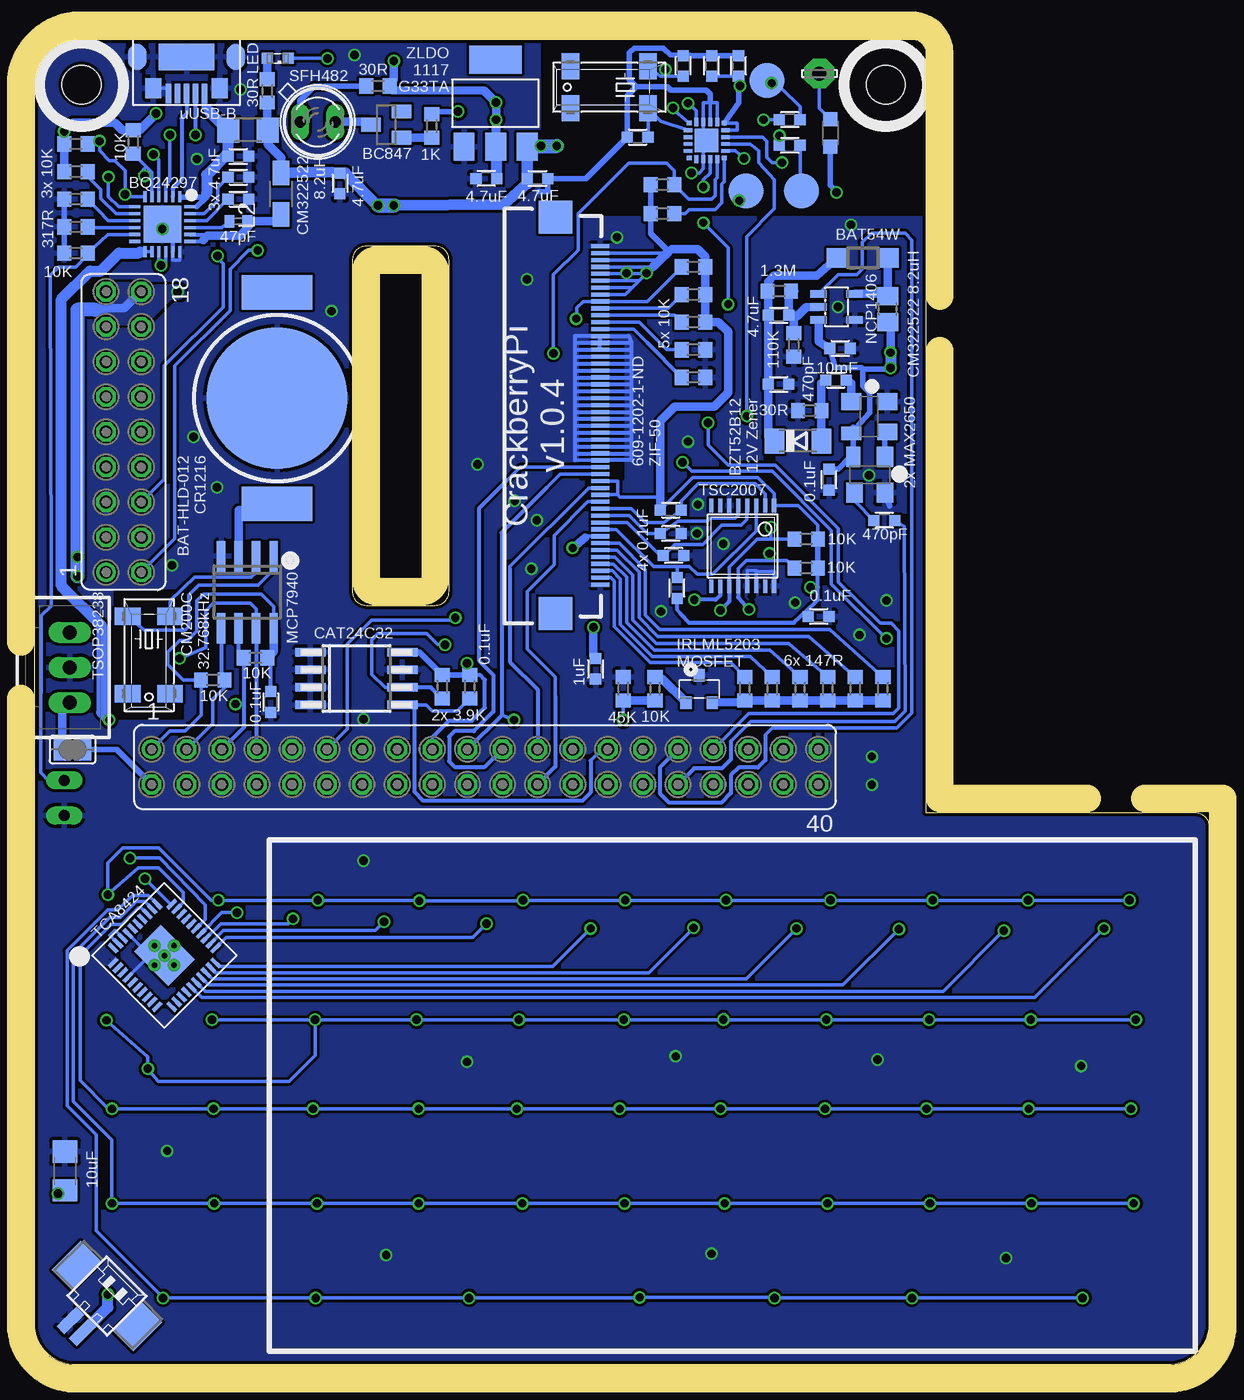
[diagram p6: board, bottom side, seen from below]

Size 85 x 96 mm. Coordinates in mm from the lower left corner, seen from the top.
Outline: 0,39 0,3 arc90 3,0 82,0 arc90 85,3 85,92.7 arc90 81.7,96 21.5,96 arc90 20.5,95 20.5,40 1,40 arc90 0,39
Outline: 56,81 61,81 arc-90 62,80 62,56 arc-90 61,55 56,55 arc-90 55,56 55,80 arc-90 56,81
Copper layers (1*16): Top 0.035mm / dielectric 1.5mm / Bottom 0.035mm
Design rules "SeeedStudio_2layer_DRU_no_angle_20140221": minimum track width 6mil, minimum drill 12mil, track to track 6mil, track to pad 6mil, pad to pad 6mil, via to via 6mil, smd to smd 0mil, copper to edge 10mil, drill to drill 10mil, minimum pad ring 10mil, minimum via ring 6mil, stop-mask expansion 2mil, vias tented up to drill 100mil, thermal gap 10mil
Holes 2.8 mm at 81.6,92.7 23.4,92.7
bKeepout: area 33,55.7 to 33.2,56.9
tRestrict: area 20.5,83.4 to 48.2,95.7
bRestrict: area 42.5,73.2 to 45.4,73.3; area 42.5,72.7 to 45.4,72.8; area 42.5,72.2 to 45.4,72.3; area 42.5,71.7 to 45.4,71.8; area 42.5,71.2 to 45.4,71.3; area 42.5,70.7 to 45.4,70.8; area 42.5,70.2 to 45.4,70.3; area 42.5,69.7 to 45.4,69.8; area 42.5,69.2 to 45.4,69.3; area 42.5,68.7 to 45.4,68.8; area 42.5,68.2 to 45.4,68.3; area 42.5,67.7 to 45.4,67.8; 14 more areas
Milling: 22 lines

### Footprints (pad centres in the part's own frame; a part is rotated, then mirrored left to right if it is on the bottom)
4MM = smd 1.7 x 1.7: IN 0,0 | smd 1 x 0.5: OUT 0,1.9
LSP10 = drill 1.016 pad 2.159 octagon: MP 0,0
B2,54 = smd 2.54 x 2.54: TP 0,0
C0603 = smd 0.8 x 0.8: 1 -0.75,0; 2 0.75,0
C0402 = smd 0.7 x 0.9: 1 -0.65,0; 2 0.65,0
C1206 = smd 1.6 x 1.8: 1 -1.4,0; 2 1.4,0
SOD123 = smd 1.4 x 1.4: A 1.9,0; C -1.9,0
SOD80C = smd 1.4 x 1.8: A 1.7,0; C -1.7,0
SFH482 = drill 0.813 long: A -1.27,0; K 1.27,0
B1,27 = smd 1.27 x 1.27: TP 0,0
SOT223 = smd 1.499 x 2.007: 1 -2.261,-3.15; 2 0.025,-3.15; 3 2.311,-3.15 | smd 3.81 x 2.007: 4 0,3.15
SO-08M = smd 0.6 x 2.2: 1 -1.905,-3.33; 2 -0.635,-3.33; 3 0.635,-3.33; 4 1.905,-3.33; 5 1.905,3.33; 6 0.635,3.33; 7 -0.635,3.33; 8 -1.905,3.33
R1206 = smd 1.6 x 1.803: 1 -1.422,0; 2 1.422,0
R0805 = smd 1.3 x 1.5: 1 -0.95,0; 2 0.95,0
R1206W = smd 1.8 x 1.2: 1 -1.499,0; 2 1.499,0
L2012C = smd 1 x 1: 1 -1,0; 2 1,0
SML0603 = smd 0.8 x 0.8: A 0.75,0; C -0.75,0
MICRO3 = smd 0.8 x 0.9: 1 -0.95,-1; 2 0.95,-1; 3 0,1
MM20SS = smd 1.27 x 1.88: 1 -2.794,-1.524; 2 2.794,-1.524; 3 2.794,1.524; 4 -2.794,1.524
R0603 = smd 1 x 1.1: 1 -0.85,0; 2 0.85,0
RS-2,5 = drill 0.813 long: 1 -1.27,0; 2 1.27,0
SJ = smd 1.168 x 1.6: 1 -0.762,0; 2 0.762,0
FE20-2 = drill 0.914: 1 -24.13,1.27 | drill 0.914 octagon: 2 -24.13,-1.27; 3 -21.59,1.27; 4 -21.59,-1.27; 5 -19.05,1.27; 6 -19.05,-1.27; 7 -16.51,1.27; 8 -16.51,-1.27; 9 -13.97,1.27; 10 -13.97,-1.27; 11 -11.43,1.27; 12 -11.43,-1.27; 13 -8.89,1.27; 14 -8.89,-1.27; 15 -6.35,1.27; 16 -6.35,-1.27; 17 -3.81,1.27; 18 -3.81,-1.27; 19 -1.27,1.27; 20 -1.27,-1.27; 21 1.27,1.27; 22 1.27,-1.27; 23 3.81,1.27; 24 3.81,-1.27; 25 6.35,1.27; 26 6.35,-1.27; 27 8.89,1.27; 28 8.89,-1.27; 29 11.43,1.27; 30 11.43,-1.27; 31 13.97,1.27; 32 13.97,-1.27; 33 16.51,1.27; 34 16.51,-1.27; 35 19.05,1.27; 36 19.05,-1.27; 37 21.59,1.27; 38 21.59,-1.27; 39 24.13,1.27; 40 24.13,-1.27
FE09-2 = drill 0.914: 1 -10.16,1.27 | drill 0.914 octagon: 2 -10.16,-1.27; 3 -7.62,1.27; 4 -7.62,-1.27; 5 -5.08,1.27; 6 -5.08,-1.27; 7 -2.54,1.27; 8 -2.54,-1.27; 9 0,1.27; 10 0,-1.27; 11 2.54,1.27; 12 2.54,-1.27; 13 5.08,1.27; 14 5.08,-1.27; 15 7.62,1.27; 16 7.62,-1.27; 17 10.16,1.27; 18 10.16,-1.27
SOT23 = smd 1 x 1.4: 1 -0.95,-1.1; 2 0.95,-1.1; 3 0,1.1
VQFN-4X4-24 = smd 0.8 x 0.23: 1 -2,1.25; 2 -2,0.75; 3 -2,0.25; 4 -2,-0.25; 5 -2,-0.75; 6 -2,-1.25; 13 2,-1.25; 14 2,-0.75; 15 2,-0.25; 16 2,0.25; 17 2,0.75; 18 2,1.25 | smd 0.23 x 0.8: 7 -1.25,-2; 8 -0.75,-2; 9 -0.25,-2; 10 0.25,-2; 11 0.75,-2; 12 1.25,-2; 19 1.25,2; 20 0.75,2; 21 0.25,2; 22 -0.25,2; 23 -0.75,2; 24 -1.25,2 | smd 2.7 x 2.7: P$1 0,0
SOT23-5L = smd 0.55 x 1.2: 1 -0.95,-1.3; 2 0,-1.3; 3 0.95,-1.3; 4 0.95,1.3; 5 -0.95,1.3
SOT143-W = smd 1.2 x 1.45: 1 -1.1,-1.3; 2 -1.1,1.3; 3 1.1,1.3 | smd 1 x 1.45: 4 1.2,-1.3
CR1216 = smd 2.5 x 5.1: + -7.65,0; P$2 7.65,0 | smd 10.2 x 10.2: GND 0,0
SO08 = smd 0.6 x 2.2: 1 -1.905,-2.6; 2 -0.635,-2.6; 3 0.635,-2.6; 4 1.905,-2.6; 5 1.905,2.6; 6 0.635,2.6; 7 -0.635,2.6; 8 -1.905,2.6
TSSOP16 = smd 0.305 x 0.991: 1 -2.275,-2.918; 2 -1.625,-2.918; 3 -0.975,-2.918; 4 -0.325,-2.918; 5 0.325,-2.918; 6 0.975,-2.918; 7 1.625,-2.918; 8 2.275,-2.918; 9 2.275,2.918; 10 1.625,2.918; 11 0.975,2.918; 12 0.325,2.918; 13 -0.325,2.918; 14 -0.975,2.918; 15 -1.625,2.918; 16 -2.275,2.918
QFN40 = smd 0.85 x 0.28: 1 -3,2.25; 2 -3,1.75; 3 -3,1.25; 4 -3,0.75; 5 -3,0.25; 6 -3,-0.25; 7 -3,-0.75; 8 -3,-1.25; 9 -3,-1.75; 10 -3,-2.25; 21 3,-2.25; 22 3,-1.75; 23 3,-1.25; 24 3,-0.75; 25 3,-0.25; 26 3,0.25; 27 3,0.75; 28 3,1.25; 29 3,1.75; 30 3,2.25 | smd 0.28 x 0.85: 11 -2.25,-3; 12 -1.75,-3; 13 -1.25,-3; 14 -0.75,-3; 15 -0.25,-3; 16 0.25,-3; 17 0.75,-3; 18 1.25,-3; 19 1.75,-3; 20 2.25,-3; 31 2.25,3; 32 1.75,3; 33 1.25,3; 34 0.75,3; 35 0.25,3; 36 -0.25,3; 37 -0.75,3; 38 -1.25,3; 39 -1.75,3; 40 -2.25,3 | smd 2.7 x 3.5: P$2 0,0 | smd 1 x 1.5: P$11 -0.65,0.9; P$12 0.65,0.9; P$13 0.65,-0.9; THERMAL -0.65,-0.9 | drill 0.4 pad 0.406: VIA1 0,1; VIA2 -1,0; VIA3 0,0; VIA4 1,0; VIA5 0,-1
QFN20-3X3 = smd 0.34 x 0.34: 1 -1.27,1.27; 6 -1.27,-1.27; 11 1.27,-1.27; 16 1.27,1.27 | smd 0.61 x 0.28: 2 -1.35,0.75; 3 -1.35,0.25; 4 -1.35,-0.25; 5 -1.35,-0.75; 12 1.35,-0.75; 13 1.35,-0.25; 14 1.35,0.25; 15 1.35,0.75 | smd 0.28 x 0.61: 7 -0.75,-1.35; 8 -0.25,-1.35; 9 0.25,-1.35; 10 0.75,-1.35; 17 0.75,1.35; 18 0.25,1.35; 19 -0.25,1.35; 20 -0.75,1.35 | smd 1.7 x 1.7: P$1 0,0
MICRO_USB = smd 0.4 x 1.4: 1_+5V -1.3,2.65; 2_D- -0.65,2.65; 3_D+ 0,2.65; 4_ID 0.65,2.65; 5_0V 1.3,2.65 | smd 4 x 1.9: GND1 0,0 | smd 1.35 x 1.9: GND2 -3.55,0; GND5 3.55,0 | smd 1.15 x 1.45: P$1 -2.4,2.25; P$7 2.4,2.25
53261-02 = smd 0.8 x 2: 1 0.625,-2.5; 2 -0.625,-2.5 | smd 2.1 x 3: S1 3.125,0.625; S2 -3.125,0.625
70543-03 = drill 1.016 long: 1 -2.54,0; 2 0,0; 3 2.54,0
FH12-50S-0.5SH = smd 1.3 x 0.3: 1 3.95,27.8; 2 3.95,27.3; 3 3.95,26.8; 4 3.95,26.3; 5 3.95,25.8; 6 3.95,25.3; 7 3.95,24.8; 8 3.95,24.3; 9 3.95,23.8; 10 3.95,23.3; 11 3.95,22.8; 12 3.95,22.3; 13 3.95,21.8; 14 3.95,21.3; 15 3.95,20.8; 16 3.95,20.3; 17 3.95,19.8; 18 3.95,19.3; 19 3.95,18.8; 20 3.95,18.3; 21 3.95,17.8; 22 3.95,17.3; 23 3.95,16.8; 24 3.95,16.3; 25 3.95,15.8; 26 3.95,15.3; 27 3.95,14.8; 28 3.95,14.3; 29 3.95,13.8; 30 3.95,13.3; 31 3.95,12.8; 32 3.95,12.3; 33 3.95,11.8; 34 3.95,11.3; 35 3.95,10.8; 36 3.95,10.3; 37 3.95,9.8; 38 3.95,9.3; 39 3.95,8.8; 40 3.95,8.3; 41 3.95,7.8; 42 3.95,7.3; 43 3.95,6.8; 44 3.95,6.3; 45 3.95,5.8; 46 3.95,5.3; 47 3.95,4.8; 48 3.95,4.3; 49 3.95,3.8; 50 3.95,3.3 | smd 2.4 x 2.4: P$1 0.7,1.2; P$2 0.7,29.9

### Placement (x,y rotation side)
0  72.16,33.63 0 top
1  5.43,33.63 0 top
2  12.86,33.63 0 top
3  20.27,33.63 0 top
4  27.68,33.63 0 top
5  35.2,33.63 0 top
6  42.51,33.63 0 top
7  49.97,33.63 0 top
8  57.33,33.63 0 top
9  64.73,33.63 0 top
!  64.73,11.71 0 top
(  72.16,18.55 0 top
)  79.56,18.55 0 top
+  79.56,25.39 0 top
,  72.16,11.71 0 top
-  79.56,33.63 0 top
.  79.56,11.71 0 top
?  57.33,11.71 0 top
@  64.73,4.87 0 top
A  5.43,18.55 0 top
ANTENNA  28.2,93.5 0 bottom
AUDIO_L  32,93 0 bottom
AUDIO_R  29.5,85 0 bottom
B  35.2,11.71 0 top
C  20.27,11.71 0 top
C1  67.91,48 270 bottom
C2  38.95,61.9 0 bottom
C3  38.5,56.25 90 bottom
C4  38.95,60.2 180 bottom
C6  26.7,73.6 0 bottom
C7  28.25,54.2 0 bottom
C8  38.05,94.05 90 bottom
C9  44.4,50.4 270 bottom
C10  70.25,82.8 180 bottom
C11  62.9,85.55 270 bottom
C12  70.25,84.4 0 bottom
C13  48.6,85.9 0 bottom
C14  52.3,85.9 180 bottom
C15  82.8,14.05 90 bottom
C16  70.25,87.5 0 bottom
C17  70.25,86 0 bottom
C18  38.75,58.6 180 bottom
C19  31.15,71 0 bottom
C20  31.15,76 0 bottom
C21  27,71.3 0 bottom
C22  27.5,64.1 90 bottom
C23  23.5,61.15 180 bottom
C24  41.35,88.9 0 bottom
C25  30.35,90.15 180 bottom
C26  30.35,88.3 180 bottom
C27  36,94.05 90 bottom
C28  34.05,94.05 90 bottom
D  20.27,18.55 0 top
D1  25.05,80.15 0 bottom
D4  29.75,66.9 0 bottom
D5  64.5,90 0 bottom
E  20.27,25.39 0 top
F  27.68,18.55 0 top
FN-RIGHT  75.86,4.87 0 top
G  35.2,18.55 0 top
GD  51,50 90 top
GND  33.5,85 0 bottom
H  42.51,18.55 0 top
I  57.33,25.39 0 top
IC1  51.65,91.35 0 bottom
IC2  61.7,49.7 270 bottom
ID-SC  45,50 90 top
ID-SD  42,50 90 top
INT  39,50 90 top
J  49.97,18.55 0 top
JUMPER  69.55,89.4 0 bottom
K  57.33,18.55 0 top
L  64.73,18.55 0 top
L1  23.25,76.45 90 bottom
L2  67.15,84.8 90 bottom
L3  27.4,89.2 90 bottom
LED1  67.4,94.6 180 bottom
M  49.97,11.71 0 top
N  42.51,11.71 0 top
O  64.73,25.39 0 top
P  72.16,25.39 0 top
Q  5.43,25.39 0 top
Q1  36.9,48.95 0 bottom
Q2  43.4,92.5 180 bottom
Q3  76.72,51.4 270 bottom
R  27.68,25.39 0 top
R1  69,51.2 0 bottom
R2  29.15,59.8 0 bottom
R3  72.1,49.6 180 bottom
R4  55.5,49.1 90 bottom
R5  53.5,49.1 90 bottom
R6  29.15,57.7 0 bottom
R7  82.85,41.05 270 top
R8  82,82.4 180 bottom
R9  82,88.4 0 bottom
R10  77.85,88.55 270 bottom
R11  39.55,85.45 0 bottom
R12  68.15,92.25 90 bottom
R13  37.3,79.5 0 bottom
R14  37.3,77.5 0 bottom
R15  37.3,75.5 0 bottom
R16  37.3,73.5 180 bottom
R17  37.3,71.5 180 bottom
R18  23.6,48.95 90 bottom
R19  25.6,48.95 90 bottom
R20  27.6,48.95 90 bottom
R21  29.6,48.95 90 bottom
R22  31.6,48.95 90 bottom
R23  33.6,48.95 90 bottom
R24  40.1,48.95 270 bottom
R25  42.4,48.95 270 bottom
R26  82,80.5 180 bottom
R27  82,84.4 0 bottom
R28  82,86.4 0 bottom
R29  39.55,83.35 0 bottom
R36  31.1,77.75 180 bottom
R37  30.05,73.85 90 bottom
R38  28.9,69.1 0 bottom
R39  60.15,92.6 0 bottom
R40  56.25,89.7 90 bottom
S  12.86,18.55 0 top
SCL  36,50 90 top
SDA  33,50 90 top
SHIFT-RIGHT  53.62,4.87 0 top
SHILFT-LEFT  9.14,4.87 0 top
SJ2  82.25,44.55 180 bottom
SPACE1  21.5,4.87 0 top
SPACE2  31.39,4.87 0 top
SPACE3  41.27,4.87 0 top
SV1  52.4,43.3 0 bottom
SV3  78.55,67.55 90 bottom
T  35.2,25.39 0 top
T1  59.55,89.8 90 bottom
U  49.97,25.39 0 top
U$1  75.75,82.6 270 bottom
U$2  26.95,76.6 270 bottom
U$3  24.6,68.65 270 bottom
U$4  67.45,70 90 bottom
U$5  69.6,55.95 180 bottom
U$6  33.75,59.3 180 bottom
U$7  75.6,29.65 45 bottom
U$8  36.35,88.65 90 bottom
U$9  74,94.7 180 bottom
U$10  24.55,64.45 180 bottom
V  27.68,11.71 0 top
V5  27,50 90 top
V33  30,50 90 top
VCC  48,50 90 top
W  12.86,25.39 0 top
X  12.86,11.71 0 top
X1  80.2,4.55 315 bottom
X3  82.45,50.5 270 bottom
X5  48,53.2 0 bottom
Y  42.51,25.39 0 top
Z  5.43,11.71 0 top

### Tracks (layer width: path | path; a pad name or v marks a point on that pad's centre or on a via)
+3V3  (via drill 0.6)
  Top 0.254: v28.85,56.3 28.85,51.15 V33.TP
  Top 0.406: v33.95,92.6 34.4,92.95 38.05,92.95 38.6,92.4 50.6,92.4 v51.6,91.4 | SV3.7 81.51,65.01 82.1,65.6 82.1,77.25 81.64,77.71 SV3.17
  Top 0.61: v59,94.4 60.5,92.9 73.9,92.9 v76.2,90.6 | v51.6,91.4 v51.6,90.15 51.6,88.55 v42.15,79.05 v40.7,79.05 | 79.95,79.5 80.15,79.5 82.55,81.9 82.55,89 v82.85,89.3 | SV3.17 79.95,77.84 79.95,79.5 | v75.85,79.6 76.2,79.85 79.6,79.85 79.95,79.5
  Bottom 0.254: C2.1 39.9,61.7 | U$1.16 75.5,79.65 76,79.65 U$1.15 76,79.6 v75.85,79.6 | U$8.11 34.15,89.92 34.15,89.4 U$8.10 | 39.8,62 C2.1 | X5.35 42.8,64 42.81,63 | 42.81,63 42.65,62.85 39.7,62.85 | R2.2 28.3,60.8 29.72,62.22 U$6.1 31.48,63.08 32.65,64.25 37.35,64.25 C2.1 | C7.1 28.96,54.76 28.5,55.21 | C27.1 C28.1 | 34.28,93.32 34,93.27 34.37,93.02 | v28.85,56.3 28.3,56.3 | 40.23,79.5 40.23,79.53 | X5.4 40.67,79.5 40.47,79.3 | X5.3 39.86,80 39.8,79.94 | X5.2 39.55,80.5 39.27,80.78 | X5.37 42.81,63 | X5.5 40.75,79 v40.7,79.05 41.25,78.5 | X5.8 42.25,77.5 41.75,78 | X5.7 41.75,78 | 41.75,78 41.25,78.5 | X5.6 41.25,78.5
  Bottom 0.305: R6.2 28.3,56.3 28.3,55.4 28.5,55.21 30.05,53.75 37.65,53.75 38.2,54.35 38.5,54.7 C3.1
  Bottom 0.406: 28.25,59.75 R2.2 R6.2 | 82.85,86.35 R28.1 | 39.1,80.6 39.27,80.78 40.4,81.9 R29.1 R11.1 | v33.95,92.6 34.1,93 | 34.1,93 C28.1 34.05,91.4 U$8.11 | 34.1,93 34.18,93.07 34,93.27
  Bottom 0.61: v59,94.4 59,93.05 R39.2 59.1,92.3 52.45,92.25 v51.6,91.4 v51.6,90.15 | 82.85,86.35 R9.1 v82.85,89.3 82.2,89.95 79.2,89.95 78.65,89.4 R10.1 77.4,89.4 v76.2,90.6 | v51.6,90.15 51.58,89.12 | IC1.2 51.62,89.12 v51.6,90.15 | C2.1 39.7,62.85 39.7,68.35 38.65,69.4 35.8,69.4 34.8,70.4 34.8,74.8 35.5,75.5 R15.2 R14.2 R13.2 36.45,80.25 37,80.8 38.9,80.8 39.1,80.6 39.8,79.94 40.23,79.53 40.47,79.3 40.47,79.28 v40.7,79.05
  Bottom 0.813: C14.1 51.55,88.13 IC1.2
+5V  (via drill 0.6)
  Top 0.254: 75.3,45.35 75.35,45.3 75.35,42 75.38,42.03 SV1.2 | V5.TP 27,68.25 v23.05,72.2
  Top 1.016: v23.05,72.2 v23.05,73.3 23.05,78.1 25.85,80.9 39.85,80.9 v47.2,88.25 v48.35,88.25 | SV3.18 68.89,77.71 62.65,83.95 v60.15,83.95 v59,83.95 55.8,83.95 53.4,81.55 53.4,68.75 46.05,61.4 v46.05,59.15 46.05,54.9 v44.55,53.4 | v81.9,58.5 81.9,55.85 80.2,54.15 80.2,53.15 78.8,51.75 78.8,50.2 75.35,46.75 75.35,45.3
  Bottom 0.254: 45.15,59.9 45.25,59.65 44.9,60 X5.43
  Bottom 0.305: 58.95,83.95 60.75,84.45 60.9,84.6 60.85,84.6 v60.15,83.95
  Bottom 0.406: C6.1 27.05,72.2 25.15,72.2 25.05,72.1 | 25.05,72.1 25.05,70.9 24.55,70.4 24.55,68.95 U$3.4 25.75,67.9 U$10.4 25.95,65.75 26.85,64.85 C22.2 | v23.05,72.2 23.15,72.1 25.05,72.1 | SV1.2 79.05,44.55 SJ2.1 SJ2.2
  Bottom 0.61: C6.1 28.25,74.1 U$2.3 | C11.1 63.45,86.35 | 45.15,59.9 v46.05,59.15 | SV3.18 78.49,76.5 80.1,76.5 79.9,76.45 80.6,76.4 | X3.3 83.01,47.6 SJ2.2 | C9.1 44.55,51.3 v44.55,53.4 | v23.05,73.3 23.05,75.3 L1.1 | R12.1 68.15,89.42 JUMPER.2 68.13,88.38 67.15,87.4 L2.2
  Bottom 0.813: 63.45,86.35 L2.2 | IC1.3 49.34,86.11 | 49.34,86.11 C13.1 49.35,88.25 | v23.05,73.3 v23.05,72.2 | 49.34,86.11 49.34,85.51 51.05,84 v59,83.95 | 58.95,83.95 60.2,83.95 62.5,86.3 C11.1
  Bottom 1.016: 49.35,88.25 v47.2,88.25 | v59,83.95 v60.15,83.95 58.95,83.95 | 80.6,76.4 81.9,76.4 v81.9,58.5 v81.9,57.1
  other vias: 74.65,77.7
  pour Top: 73.6,41.3 76.95,41.25 77,44.9 75.9,45.45 74.6,45.45 73.65,45
  pour Bottom: 77,78.3 79.15,78.3 80.25,77.2 80.25,76.45 79.2,75.4 77,75.4 75.15,77.25 74.6,77.25 arc-90 74.2,77.65 arc-90 74.65,78.1 76.85,78.1
+15V
  Bottom 0.61: D4.C 31.9,67.2 C19.1 C20.1 31.9,77.45 | 31.9,77.45 R36.2 | 31.9,77.45 31.9,78.45 31.5,78.85 28.4,78.85 D1.C
AUDIO_L  (via drill 0.6)
  Bottom 0.254: 31.45,93 30.9,92.35 | 30.9,92.35 v31.65,92.8 32,92.2 | C25.1 29.6,91.1 30.9,92.35
  Bottom 0.406: v31.65,92.8 31.65,93 AUDIO_L.TP
AUDIO_R
  Bottom 0.254: C26.1 29.6,85.1 AUDIO_R.TP
BASE
  Bottom 0.61: T1.1 R40.1
CE0
  Bottom 0.254: 47.3,48.4 47.3,49.8 49.35,51.85 49.35,56 47.4,57.95 47.4,60.05 44.95,62.5 X5.38
  Bottom 0.305: 47.3,48.4 47.3,43.32 SV1.24
COL0  (via drill 0.6)
  Top 0.254: 1.IN 5.73,33.63 v5.75,33.65 | v13.1,33.65 12.84,33.65 2.IN | 3.IN 20.02,33.63 v20,33.65 | 4.IN 27.42,33.63 v27.4,33.65 | 5.IN 34.97,33.63 v34.95,33.65 | 6.IN 42.27,33.63 v42.25,33.65 | 7.IN 49.67,33.63 v49.65,33.65 | 8.IN 57.18,33.63 v57.15,33.6 | 9.IN 64.52,33.63 v64.5,33.65 | 0.IN 71.92,33.63 v71.7,33.65 | -.IN 80.27,33.63 v79.7,34.05
  Bottom 0.254: v5.75,33.65 v13.1,33.65 v20,33.65 20.02,33.63 3.IN 20.29,33.65 v27.4,33.65 27.42,33.63 4.IN 27.7,33.65 v34.95,33.65 v42.25,33.65 42.27,33.63 6.IN 42.52,33.65 v49.65,33.65 49.7,33.6 v57.15,33.6 57.18,33.63 8.IN 57.34,33.65 v64.5,33.65 64.52,33.63 9.IN 64.75,33.65 v71.7,33.65 72.2,33.65 76,37.45 78.6,37.45 79.7,36.35 v79.7,34.05 77.5,36 76,36 74.25,34.2 74.25,33.48 U$7.29
COL1  (via drill 0.6)
  Top 0.254: Q.IN 5.6,25.39 v5.3,25 | v12.9,25 W.IN | E.IN 20.3,24.99 20.3,25.05 | 27.55,25.39 R.IN 27.7,25.02 v27.7,25 | 27.55,25.39 v27.7,25 | T.IN 35.05,25.39 v35.15,25 | Y.IN 42.35,25.39 v42.35,25 | U.IN 49.8,25.39 v49.95,25 | I.IN 57.16,25.39 v57.35,25 | O.IN 64.59,25.39 v64.7,25 | P.IN 72.01,25.39 v72.15,25 | +.IN 80.3,25.39 v79.8,24.95 | v76.8,21.45 76.8,26.65 78.25,28.1 78.25,31 76.85,32.45 76.85,34.9 v77,35.2 | 20.1,25 v20.25,25 | v20.25,25 20.3,25.05 | 20.3,25.05 20.35,25 v20.25,25 | 27.55,25.39 27.6,25.34 27.6,25 v27.7,25
  Bottom 0.254: v5.3,25 v12.9,25 | v12.9,25 W.IN | v27.7,25 v35.15,25 35.05,25.39 T.IN 35.2,25 v42.35,25 v42.35,24.99 42.51,24.99 42.66,25 v49.95,25 49.94,25.04 50.06,25.04 50.17,25 v57.35,25 v64.7,25 | v27.7,25 v12.9,25 | v64.7,25 64.79,24.94 64.78,24.99 65.19,25 v72.15,25 | U$7.30 75.12,33.32 v77,35.2 | v79.8,24.95 76.8,22.3 v76.8,21.45 76.05,20.55 66.55,20.55 64.7,22.4 v64.7,25 | v20.25,25 v27.7,25
COL2  (via drill 0.6)
  Top 0.254: SHILFT-LEFT.IN 9.28,4.87 arc-90 v9.15,4.85 | v21.5,4.85 21.52,4.85 SPACE1.IN | SPACE2.IN 31.27,4.87 v31.45,4.85 | SPACE3.IN 41.23,4.87 v41.2,4.9 | SHIFT-RIGHT.IN 53.57,4.87 v53.55,4.85 | @.IN 64.67,4.87 v64.65,4.85 | FN-RIGHT.IN 75.72,4.87 v75.7,4.85
  Bottom 0.254: v75.7,4.85 v64.65,4.85 v53.55,4.85 41.25,4.85 v41.2,4.9 31.41,4.9 SPACE2.IN 31.43,4.87 v31.45,4.85 v21.5,4.85 v9.15,4.85 | U$7.31 76.77,34 77.9,34 79,32.95 79.7,32.95 82.65,30 82.65,18.75 80.55,16.65 80.55,9.7 v75.7,4.85 | FN-RIGHT.IN 75.72,4.87 v75.7,4.85
COL3  (via drill 0.6)
  Top 0.254: Z.IN 5.25,11.7 v5.45,11.7 | v12.85,11.7 13.49,11.71 X.IN | C.IN 20.25,11.7 v20.2,11.7 | V.IN 27.66,11.7 v27.6,11.7 | B.IN 35.19,11.7 v35.05,11.7 | N.IN 42.49,11.7 v42.3,11.7 | M.IN 49.95,11.7 v49.7,11.7 | ?.IN v57.2,11.71 v57.2,11.7 | !.IN v64.55,11.71 v64.55,11.7 | ,.IN v72,11.71 v72,11.7 | ..IN v79.4,11.71 v79.4,11.7
  Bottom 0.254: v5.45,11.7 v12.85,11.7 v20.2,11.7 20.25,11.7 C.IN v27.59,11.71 v27.6,11.7 27.66,11.7 V.IN v35.04,11.71 v35.05,11.7 v42.3,11.7 42.49,11.7 N.IN 49.15,11.71 | v49.7,11.7 v49.69,11.71 49.15,11.71 | 49.15,11.71 49.15,11.7 v57.2,11.7 v64.55,11.7 v72,11.7 v79.4,11.7 | U$7.32 77.03,33.55 77.65,33.55 78.8,32.4 79.55,32.4 82.2,29.75 82.2,19.1 79.4,16.3 v79.4,11.7 | ..IN v79.41,11.71 v79.4,11.7
COL4  (via drill 0.6)
  Top 0.254: ).IN v79.4,18.55 | v72.05,18.55 (.IN | L.IN v64.85,18.55 | K.IN v57.2,18.55 | J.IN v50.1,18.55 | H.IN v42.65,18.55 | G.IN v35.35,18.55 | F.IN v27.8,18.55 | D.IN v20.45,18.55 | S.IN v13.05,18.55 | A.IN v5.65,18.55
  Bottom 0.254: v5.65,18.55 v13.05,18.55 v20.45,18.55 v27.8,18.55 v35.35,18.55 v42.65,18.55 v50.1,18.55 v57.2,18.55 v64.85,18.55 v72.05,18.55 v79.4,18.55 79.65,18.55 81.7,20.6 81.7,29.65 79.45,31.9 78.7,31.9 77.5,33.1 77.28,33.1 U$7.33
COLLECTOR
  Bottom 0.61: T1.3 60.75,90 D5.K
D+
  Bottom 0.305: U$9.3_D+ 74,90.6 74.35,90.25 74.35,85.8 75,85.15 U$1.2
D-  (via drill 0.6)
  Top 0.305: v75.2,89.05 v73.35,89.05
  Bottom 0.254: U$1.3 75.5,85.45 75.2,85.75 v75.2,89.05
  Bottom 0.305: v73.35,89.05 U$9.2_D-
DE
  Bottom 0.254: 40.65,74 41.65,75 X5.13
  Bottom 0.305: R17.2 40.65,74
DISPLAY_RESET  (via drill 0.6)
  Top 0.254: v36.25,68.2 38.25,68.2 v45.8,75.75
  Bottom 0.254: SV1.33 33.31,47.15 22.85,47.15 22.45,47.55 22.45,53.15 23,53.7 23.8,53.7 26.85,56.7 26.85,60.55 31.4,65.15 34.8,65.15 36.25,66.6 v36.25,68.2 | v45.8,75.75 45.75,76.55 45.3,77 X5.9 40.65,77 R13.1
FB
  Bottom 0.61: 30.4,77.5 R36.1 | C20.2 30.05,76 R37.2 | R36.1 30,77.75 | U$2.2 29.15,76.6 29.8,75.95 30.35,75.95 C20.2 | C20.2 30.4,77.35 R36.1
FM_RST  (via drill 0.6)
  Top 0.254: v38.1,65.35 46,73.25 v47.45,73.25 | v23.35,52.6 23.35,50.3 25.8,47.85 29.85,47.85 30.81,46.89 SV1.37
  Bottom 0.254: v23.35,52.6 27.35,56.55 27.35,60.4 31.6,64.7 37.45,64.7 v38.1,65.35 | v47.45,73.25 47.45,78.95 45.65,80.7 45.65,83.35 42,87 39.25,87 38.7,86.45 R11.2 37.65,84.4 36,84.4 35.75,84.65 35.75,85.8 35.6,85.95 U$8.5
GND  (via drill 0.6)
  Top 0.254: v37.45,86.3 37.55,86.2 37.55,84.7 37.15,84.3 v34,84.3 27.55,84.3 v26.95,84.9 26.95,82.55 v25.9,82.55
  Bottom 0.254: U$1.18 74.5,80 75,80 U$1.17 | 76.75,29.9 76.8,29.95 76.96,29.95 U$7.37 | 76.75,29.9 75.42,28.57 U$7.THERMAL | U$8.12 35.6,91.4 36.1,91.4 | 36.1,91.4 36.6,91.4 U$8.14 36.6,89.55 U$8.P$1 36.6,89.3 U$8.3 36.6,86.6 36.9,86.3 v37.45,86.3 | U$8.13 36.1,91.4 | GND.TP 34.2,84.3 v34,84.3 | 45.9,65.5 44,65.5 | U$9.5_0V 75.3,92.45 U$9.P$7 | U$6.13 33.42,57.5 32.75,57.5 32.75,57.45 | 32.75,56.45 32.75,56.38 U$6.14 | U$6.16 31.48,57.45 32.75,57.45 | 32.75,57.45 32.75,56.45 | 32.75,56.45 32.8,56.45 | 76.31,29.94 76.31,29.9 76.75,29.9 | U$7.4 76.31,30 U$7.VIA1
  Bottom 0.305: 44.1,73.5 X5.14 | X5.14 42,74.5 41.8,74 | 41.8,74 41.8,73.5 | 41.8,73.5 41.8,73 | 41.8,73 41.8,72.5 | 41.8,72.5 41.8,72 | 41.8,72 41.8,71.5 | 41.8,71.5 41.8,71 | 41.8,71 41.8,70.5 | 41.8,70.5 41.8,70 | 41.8,70 41.8,69.5 | 41.8,68.5 41.8,68 | 41.8,68 41.8,67.5 | 41.8,67.5 41.8,67 | 41.8,67 41.8,66.5 | 41.8,66.5 41.8,66 | 41.8,66 41.8,65.5 44,65.5 X5.32 | 41.8,66 X5.31 45.9,66 | 41.8,66.5 X5.30 45.9,66.5 | 41.8,67 X5.29 45.9,67 | 41.8,67.5 X5.28 45.9,67.5 | 41.8,68 X5.27 45.9,68 | 41.8,68.5 X5.26 45.9,68.5 | 41.8,69.5 X5.24 45.9,69.5 | 41.8,69.5 41.8,69 | 41.8,69 X5.25 45.9,69 | 41.8,69 41.8,68.5 | 41.8,70 X5.23 45.9,70 | 41.8,70.5 X5.22 45.9,70.5 | 41.8,71 X5.21 45.9,71 | 41.8,71.5 X5.20 45.9,71.5 | 41.8,72 X5.19 45.9,72 | 41.8,72.5 X5.18 45.9,72.5 | 41.8,73 X5.17 45.9,73 | 41.8,74 X5.15 45.9,74 | 41.8,73.5 X5.16 45.9,73.5 | X5.14 45.9,74.5 45.9,74 | 45.9,74 45.9,73.5 | 45.9,73.5 45.9,73 | 45.9,73 45.9,72.5 | 45.9,72.5 45.9,72 | 45.9,72 45.9,71.5 | 45.9,71.5 45.9,71 | 45.9,71 45.9,70.5 | 45.9,70.5 45.9,70 | 45.9,70 45.9,69.5 | 45.9,69.5 45.9,69 | 45.9,69 45.9,68.5 | 45.9,68.5 45.9,68 | 45.9,68 45.9,67.5 | 45.9,67.5 45.9,67 | 45.9,67 45.9,66.5 | 45.9,66.5 45.9,66 | 45.9,66 45.9,65.5 | U$1.P$1 75,81.85 U$1.17 | 76.31,29.94 U$7.VIA1
  Bottom 0.406: 23.1,62.2 U$10.2 | R26.2 R8.2 R27.1 | R38.1 29.4,69.45 | 41.45,92.55 42.1,91.9 C24.1 45.1,85.9 C13.2 47.85,84.95 48.5,84.95 | 41.45,92.55 39.2,92.55 38.95,92.3 36.4,92.3 36.1,92 36.1,91.4 | C28.2 C27.2 | C27.2 C8.2 | C27.2 39,94.85 39.5,95.35 41.6,95.35 41.95,95 41.95,93.05 41.45,92.55 | L3.1 27.4,85.4 v26.95,84.9
  other vias: 75.05,57.9 37.05,60.2 35.15,59.45 37,62.3 29.95,55.2 24.6,64.4 25.3,52.85 23.35,55.35 73.5,67.2 71.8,63.55 61.2,46.75 49.05,57.65 48.65,61.15 50.25,62.55 37.7,66.85 73.25,87.3 63.5,76.3 52.95,65.2 9.25,21.65 24,22.1 38.6,22.35 53.7,21.95 61.2,36.5 75.4,15.5 59.55,7.95 36,8.05 14.7,7.75 39.65,54.55 49.35,78.6 42.85,81.65 61.85,94.85 70.1,92.35 75.75,82.25 26.85,76.6 24.4,44.05 24.4,42
  pour Bottom (isolate 0.2, rank 2): 0,39 0,3 arc90 3,0 82,0 arc90 85,3 85,92.6 arc90 81.6,96 21.36,95.9 arc90 20.5,95.04 20.5,40 1,40 arc90
  pour Top (isolate 0.2, rank 2): 0,39 0,3 arc90 3,0 82,0 arc90 85,3 85,92.6 arc90 81.6,96 21.5,96 arc90 20.5,95 20.5,40 1,40 arc90
GPIO22
  Top 0.254: SV1.15 58.75,47.15 60.65,49.05 64.35,49.05 68.35,53.05 68.35,65.75 71.15,68.55 76.28,68.55 SV3.10
GPIO23
  Top 0.254: SV1.16 60.07,43.35 62.15,43.35 62.6,43.8 62.6,45 63.4,45.8 65.7,45.8 71.75,51.85 71.75,61.95 73.55,63.75 77.75,63.75 78.55,64.55 78.55,66.28 SV3.9
GPIO24
  Top 0.254: SV3.11 78.5,68.72 78.5,67 77.7,66.25 70.7,66.25 69.35,64.9 69.35,52.45 64.9,48 61.2,48 60.05,46.85 60.05,44.05 59.25,43.25 57.43,43.25 SV1.18
GPIO25
  Top 0.254: SV1.22 51.73,42.03 53,43.3 54.45,43.3 55,43.85 55,45.35 59.8,50.15 63.85,50.15 67.15,53.45 67.15,66.4 70.84,70.09 SV3.12
GPIO27
  Top 0.254: SV1.13 61.29,45.54 62.5,46.8 65.15,46.8 70.7,52.35 70.7,64.45 71.25,65 SV3.8
H_SYNC
  Bottom 0.254: R15.1 38.65,76 X5.11
ID_SC  (via drill 0.6)
  Top 0.254: SV1.28 44.7,43.22 44.7,45.4 45,45.7 ID-SC.TP 48.05,53.05 53.5,53.05 54.4,52.15 v55.3,52.15
  Bottom 0.254: IC2.6 58.38,49.05 59.6,49.05 60.6,50 60.6,52.5 60.15,52.95 56.6,52.95 55.8,52.15 v55.3,52.15
  Bottom 0.305: R4.1 56.31,49.06 IC2.6
ID_SD
  Top 0.254: ID-SD.TP 42,50.35 44,48.3 44,45.06 SV1.27
  Bottom 0.254: SV1.27 43.93,44.57 44.75,43.75 | R5.1 54.4,47.35 56.2,47.35 56.65,47.8 57.85,47.8 IC2.5
  Bottom 0.305: 44.75,43.75 44.75,41.45 45.35,40.85 56.85,40.85 57.5,41.5 57.5,47.45 57.85,47.8
IN_1
  Bottom 0.61: U$3.1 25.9,71.1 C21.2
INT  (via drill 0.6)
  Top 0.254: 70.85,83.05 70.7,83.05 68.2,85.5 55,85.5 51.8,82.3 51.8,72.2 37.25,57.65 v37.25,55.4 39,53.65 INT.TP | v74.5,51.15 74.5,54.61 SV3.2 | v68.85,80.7 70.85,83.05 | 70.85,83.05 71,83.2 79.45,83.2 80.3,84.05 80.3,85.35 v79.65,86
  Bottom 0.254: U$1.7 78.9,83.85 79.65,84.6 v79.65,86 | 68.97,52.85 68.97,54.72 69.4,55.15 72.05,55.15 72.6,54.6 72.6,51.95 v74.5,51.15 | SV3.2 74.85,59.82 74.85,72.35 70.85,76.35 70.85,79.35 69.5,80.7 v68.85,80.7
  Bottom 0.305: U$5.7 68.97,52.85 68.97,44.62 SV1.7 | U$6.10 35.38,55.73 35.7,55.4 v37.25,55.4
IR_RX
  Top 0.254: X3.1 81.69,53.04 80.1,51.45 80.1,49.7 78.1,47.7 78.1,40.65 76.95,39.5 34.1,39.5 33.35,40.25 SV1.36
IR_TX  (via drill 0.6)
  Top 0.254: v54.35,90.75 54.35,93.05 52.35,95.05 26.75,95.05 26.45,94.75 26.45,91.7 24.4,89.65 22.6,89.65 21.55,88.6 21.55,41.8 23.9,39.45 30.05,39.45 30.81,40.21 SV1.38
  Bottom 0.406: R40.2 56.05,90.75 v54.35,90.75
LEDK1
  Bottom 0.254: R18.2 27.45,53.25 39.75,53.25 40.8,54.3 40.8,57.6 42.7,59.5 X5.44
  Bottom 0.305: 23.85,49.8 R18.2
LEDK2
  Bottom 0.254: R19.2 28.95,52.75 39.9,52.75 41.25,54.1 41.25,57.4 42.85,59 X5.45
LEDK3
  Bottom 0.254: R20.2 30.4,52.25 40,52.25 41.7,53.95 41.7,57.2 43,58.5 X5.46
LEDK4
  Bottom 0.254: R21.2 31.8,51.75 40.15,51.75 42.15,53.75 42.15,57.05 43.1,58 X5.47
LEDK5
  Bottom 0.254: R22.2 33.2,51.3 40.3,51.3 42.6,53.6 42.6,56.9 43.2,57.5 X5.48
LEDK6
  Bottom 0.254: R23.2 34.6,50.85 40.45,50.85 43.05,53.45 43.05,56.75 43.3,57 X5.49
LX
  Bottom 0.61: D1.A 23.05,79.95 23.25,79.75 L1.2 23.1,77.55 U$2.5
MISO
  Top 0.254: SV3.13 78.54,71.35 70.1,71.35 65.9,67.15 65.9,54.1 63.2,51.3 59.55,51.3 54.6,46.35 52.95,46.35 51.17,44.57 SV1.21
  Bottom 0.254: X5.33 49.85,65 50.85,64
  Bottom 0.305: SV1.21 52.4,43.3 54.6,43.3 55,43.7 55,45.5 54.6,45.9 53.2,45.9 51.8,47.3 51.8,49.95 52.8,50.95 52.8,62.05 50.85,64
MOSI  (via drill 0.6)
  Top 0.254: 77.25,72.6 SV3.14 69.38,72.63 64.45,67.7 64.45,54.1 62.75,52.4 59.55,52.4 54.2,47.05 50.6,47.05 v50.3,46.7
  Bottom 0.254: v50.3,46.7 51.2,47.05 | 47.95,63.5 46.95,64.5 X5.34
  Bottom 0.305: SV1.19 51.2,47.04 51.2,47.05 51.2,60.25 47.95,63.5
N$1
  Bottom 0.305: U$1.19 72.9,81.35 72.8,81.45 | U$1.20 72.4,81.85 72.5,81.75
  Bottom 0.61: L2.1 67.35,82.8 C10.1 69.5,82.45 70.1,81.75 72.5,81.75 72.8,81.45
N$2
  Bottom 0.254: U$1.21 71.45,82.35 C10.2
N$3  (via drill 0.6)
  Top 0.813: v79.7,5.1 83.3,8.7 v83.3,12.4 83.3,12.6 83.3,35.55 79.6,39.25 v79.6,46.7
  Bottom 0.254: U$1.14 U$1.13 77.35,80.6 | C15.1 83.05,12.65 v83.3,12.4
  Bottom 0.813: X1.1 79.7,4.17 v79.7,5.1 | v79.6,46.7 80.15,47.25 80.15,53.5 83.05,56.4 83.05,77.15 81,79.2 80.2,79.2 78.9,80.5 77.45,80.5 77.35,80.6
N$4
  Bottom 0.61: LED1.A R12.2
N$5
  Bottom 0.254: U$1.22 72.55,82.85 C12.1
N$6
  Bottom 0.254: 81.15,80.3 R26.1 | R26.1 81.7,79.8 82,79.5 83.25,79.5 83.85,78.9 83.8,57.7 83.8,54.95 84.5,54.25 84.55,42.88 83.99,42.32 R7.1 | U$1.11 79.7,81.85 R26.1
N$7
  Bottom 0.254: U$1.10 80.85,82.35 R8.1
N$8
  Bottom 0.254: U$1.23 72.7,83.35 71.75,84.3 71.75,85.25 C17.1
N$9  (via drill 0.6)
  Top 0.254: v63.8,94.6 75.15,94.6 77.85,91.9 77.85,89 77.5,88.7 v76.4,87.65
  Bottom 0.254: U$1.4 76,87.25 v76.4,87.65 | v63.8,94.6 LED1.C
N$11
  Bottom 0.254: U$5.1 67.69,57.6 68.8,56.45 73.1,56.45 73.85,55.75 73.85,53.45 74.1,53.2 77.05,53.2 Q3.1
N$12
  Bottom 0.61: R18.1 R19.1 R20.1 R21.1 R22.1 R23.1 33.6,48 Q1.2
N$13
  Bottom 0.254: U$5.2 68.97,57.38 69.3,57.05 73.39,57.05 75.2,55.34 Q3.4
N$15
  Bottom 0.254: 80.95,83.95 R27.2 79.65,82.85 U$1.9
N$16
  Bottom 0.61: C21.1 28.05,71.1 R38.2 D4.A
N$17
  Bottom 0.254: U$1.8 79.1,83.35 80.2,84.45 80.2,85.1 81.15,86.05 R28.2
N$19
  Bottom 0.254: U$8.17 39.68,90.05 Q2.4 40.6,91.42 C24.2
N$20
  Bottom 0.61: Q1.1 39.6,49.7 R24.1
N$21  (via drill 0.6)
  Top 0.254: v39.35,93.8 39.05,94.05 30.75,94.05 29.75,93.05 29.75,88.2 v30.9,87.05
  Bottom 0.254: 40.58,94.5 Q2.1 39.73,93.3 39.35,93.3 | C8.1 39.35,93.3 | v39.35,93.8 39.35,93.3 | U$8.9 32.3,88.9 32,88.6 32,87.45 31.6,87.05 v30.9,87.05
N$22  (via drill 0.6)
  Top 0.254: v32.25,90.15 32.3,90.2 38,90.2 v38.8,91
  Bottom 0.254: U$8.16 38.37,90.57 v38.8,91 | C25.2 v32.25,90.15
N$23  (via drill 0.6)
  Top 0.254: v37.7,91.35 37.55,91.2 33.2,91.2 32.85,91.55 31.45,91.55 30.9,91 30.9,89.2 v31.1,89
  Bottom 0.254: C26.2 v31.1,89 | v37.7,91.35 37.1,90.8 U$8.15
N$25  (via drill 0.6)
  Top 0.254: ANTENNA.MP 28.2,87.05 29.6,85.65 36.25,85.65 v36.6,85.3
  Bottom 0.254: L3.2 28.2,91 ANTENNA.MP | U$8.4 36.1,86.3 36.6,85.8 v36.6,85.3
N$26
  Bottom 0.254: R29.2 37.9,83.35 37.6,83.65 35.75,83.65 35.25,84.15 35.25,85.5 35.08,85.67 U$8.6
N$30
  Bottom 0.406: D5.A 65.8,90.03 65.8,91.55 64.75,92.6 R39.1
OUT1_IN2
  Bottom 0.406: U$3.3 23.45,67.85 U$10.1
OUT2
  Bottom 0.254: 25.6,63.1 25.6,62.5 C23.2
  Bottom 0.305: U$10.3 25.6,63.1
P_CLK
  Bottom 0.254: R16.2 39.25,73.5 41.25,75.5 X5.12
PWM  (via drill 0.6)
  Top 0.254: v42.4,46.7 40.5,48.6 40.5,50.7 41.5,51.7 45.2,51.7 48.1,54.6 54.05,54.6 v54.55,54.1
  Bottom 0.254: SV1.11 62.35,46.05 62.35,52.2 60.6,53.95 54.75,53.95 v54.55,54.1 | v42.4,46.7 R25.2
  Bottom 0.61: R24.2 R25.2
RANDOM
  Bottom 0.254: 34.6,45.15 33.15,46.6 22.75,46.6 22,47.35 22.05,60.71 22.72,61.13
  Bottom 0.305: C23.1 22.72,61.13 | 34.6,45.15 34.6,43.85 35.25,43.2 37.26,43.2 SV1.32
ROW0  (via drill 0.6)
  Top 0.254: SHILFT-LEFT.OUT 9.12,6.75 8.2,6.75 6.85,8.1 6.85,10.35 arc90 7.4,10.9 7.4,11.65 arc90 Z.OUT Z.OUT arc-90 5.4,13.64 5.4,16.4 arc-90 3.4,18.4 3.4,18.55 arc-90 5.3,20.45 A.OUT arc-90 5.4,20.48 5.4,23.35 arc-90 3.45,25.3 3.45,25.4 arc-90 5.34,27.29 Q.OUT arc90 5.45,27.3 5.45,31.65 | 1.OUT 1.OUT arc90 3.5,33.6 arc90 5.45,31.65 | v7.6,31.6 7.55,31.65 5.45,31.65
  Bottom 0.254: U$7.15 72.9,26.6 12.6,26.6 v7.6,31.6
ROW1  (via drill 0.6)
  Top 0.254: 2.OUT 12.73,35.53 arc90 10.85,33.65 10.85,33.55 arc90 12.85,31.55 | 12.85,31.55 W.OUT arc90 W.OUT 12.74,27.29 arc90 10.85,25.4 10.85,25.35 arc90 12.9,23.3 12.9,20.5 arc-90 S.OUT 12.75,20.45 arc90 10.85,18.55 10.85,18.45 arc90 12.85,16.45 X.OUT arc90 X.OUT | v14.85,31.45 14.75,31.55 12.85,31.55
  Bottom 0.254: U$7.16 72.65,27.05 19.25,27.05 v14.85,31.45
ROW2  (via drill 0.6)
  Top 0.254: SPACE1.OUT 20.25,8.02 20.25,9.65 arc90 22.2,11.6 22.2,11.75 arc90 20.34,13.61 C.OUT arc90 20.3,13.64 20.3,16.55 arc-90 18.3,18.55 arc-90 20.2,20.45 D.OUT arc-90 20.25,20.46 20.25,23.3 arc-90 18.25,25.3 18.25,25.4 arc-90 20.14,27.29 E.OUT arc-90 20.25,27.3 20.25,31.55 | 3.OUT 20.18,35.53 arc90 18.3,33.65 18.3,33.5 arc90 20.25,31.55 | v22.45,31.55 20.25,31.55
  Bottom 0.254: U$7.17 72.39,27.5 26.5,27.5 v22.45,31.55
ROW3  (via drill 0.6)
  Top 0.254: 4.OUT 27.53,35.53 arc90 25.65,33.65 arc90 27.7,31.6 27.7,31.35 | 27.7,31.35 27.7,27.32 arc-90 R.OUT 27.59,27.29 arc90 25.7,25.4 25.7,25.2 arc90 27.65,23.25 27.65,20.48 arc90 F.OUT 27.6,20.45 arc90 25.7,18.55 25.7,18.45 arc90 27.65,16.5 27.65,13.63 arc90 V.OUT 27.79,13.61 arc-90 29.7,11.7 29.7,11.05 arc-90 29,10.35 29,8.3 30.55,6.75 31.36,6.75 SPACE2.OUT | v29.85,31.6 27.95,31.6 27.7,31.35
  Bottom 0.254: U$7.18 72.13,27.95 33.5,27.95 v29.85,31.6
ROW4  (via drill 0.6)
  Top 0.254: B.OUT arc90 B.OUT 35.2,16.5 arc-90 33.25,18.45 33.25,18.55 arc-90 35.15,20.45 G.OUT arc90 G.OUT 35.2,23.35 arc-90 33.3,25.25 33.3,25.4 arc-90 T.OUT T.OUT arc90 T.OUT 35.2,31.5 | 5.OUT 35.03,35.53 arc90 33.15,33.65 33.15,33.55 arc90 35.2,31.5 | v37.3,31.65 35.35,31.65 35.2,31.5
  Bottom 0.254: U$7.19 71.88,28.4 40.55,28.4 v37.3,31.65
ROW5  (via drill 0.6)
  Top 0.254: 6.OUT 42.48,35.53 arc90 40.55,33.6 40.55,33.45 arc90 42.5,31.5 | 42.5,31.5 Y.OUT arc90 Y.OUT 42.49,27.29 arc90 40.6,25.4 40.6,25.3 arc90 42.5,23.4 H.OUT arc90 H.OUT 42.4,20.45 arc90 40.45,18.5 40.45,18.45 arc90 42.5,16.4 N.OUT arc90 N.OUT 42.41,13.61 arc90 40.5,11.7 40.5,11.2 arc90 41.75,9.95 41.27,9.46 SPACE3.OUT | v44.75,31.6 42.6,31.6 42.5,31.5
  Bottom 0.254: U$7.20 71.62,28.85 47.5,28.85 v44.75,31.6
ROW6  (via drill 0.6)
  Top 0.254: SHIFT-RIGHT.OUT 53.6,6.75 52.65,6.75 51.35,8.05 51.35,10.25 arc90 52,10.9 52,11.7 arc90 50.09,13.61 M.OUT arc-90 49.95,13.62 49.95,16.5 arc-90 47.9,18.55 47.9,18.6 arc-90 49.75,20.45 J.OUT arc-90 49.95,20.46 49.95,23.4 arc-90 48,25.35 48,25.4 arc-90 49.89,27.29 U.OUT arc90 50,27.32 50,31.5 | 7.OUT 49.93,35.53 arc90 48,33.6 48,33.5 arc90 50,31.5 | v52.3,31.95 50.45,31.95 50,31.5
  Bottom 0.254: U$7.21 71.12,30.95 53.3,30.95 v52.3,31.95
ROW7  (via drill 0.6)
  Top 0.254: 8.OUT 57.23,35.53 arc90 55.3,33.6 55.3,33.5 arc90 57.3,31.5 | 57.3,31.5 57.3,27.32 arc90 I.OUT 57.19,27.29 arc90 55.3,25.4 arc90 57.35,23.35 57.35,20.48 arc-90 K.OUT 57.3,20.45 arc90 55.4,18.55 55.4,18.35 arc90 57.3,16.45 57.3,13.63 arc90 ?.OUT | v59.7,32.1 58.4,32.1 57.8,31.5 57.3,31.5
  Bottom 0.254: U$7.22 71.33,31.45 60.35,31.45 v59.7,32.1
ROW8  (via drill 0.6)
  Top 0.254: @.OUT arc90 64.75,6.79 64.75,9.65 arc-90 62.7,11.7 arc-90 64.61,13.61 !.OUT arc-90 64.7,13.64 64.7,16.5 arc-90 62.75,18.45 62.75,18.55 arc-90 64.65,20.45 L.OUT arc90 64.75,20.46 64.75,23.25 arc-90 62.7,25.3 62.7,25.35 arc-90 64.64,27.29 O.OUT arc90 64.75,27.3 64.75,31.5 | 9.OUT 64.63,35.53 arc90 62.7,33.6 62.7,33.55 arc90 64.75,31.5 | v66.3,32.3 65.95,32.3 65.35,31.5 64.75,31.5
  Bottom 0.254: U$7.23 71.53,31.95 66.65,31.95 v66.3,32.3
ROW9  (via drill 0.6)
  Top 0.254: (.OUT 72.1,20.45 arc90 70.2,18.55 70.2,18.5 arc90 72.2,16.5 72.2,13.65 arc-90 ,.OUT 72.34,13.61 arc-90 74.2,11.75 74.2,11.05 arc-90 73.45,10.3 73.45,8.35 75,6.8 75.83,6.8 FN-RIGHT.OUT | (.OUT arc90 (.OUT | 0.OUT 71.88,35.53 arc90 70.1,33.75 | 70.1,33.75 arc90 72.2,31.65 72.2,27.34 arc-90 P.OUT 72.04,27.29 arc90 70.15,25.4 70.15,25.35 arc90 72.15,23.35 72.16,23.34 (.OUT | v70.35,32.75 70.5,33.2 70.15,33.2 70.1,33.25 70.1,33.75
  Bottom 0.254: U$7.24 71.44,32.75 v70.35,32.75
ROW10  (via drill 0.6)
  Top 0.254: 79.55,27.3 arc90 +.OUT | +.OUT 79.49,27.29 arc90 77.6,25.4 77.6,25.35 arc90 79.6,23.35 79.6,20.48 arc-90 ).OUT ).OUT arc90 77.65,18.55 77.65,18.5 arc90 79.55,16.6 79.55,13.62 arc90 ..OUT | v78.1,36.7 79.27,35.53 -.OUT 79.48,35.53 arc90 77.6,33.65 77.6,33.55 arc90 79.55,31.6 78.75,31.6 78.75,27.29 +.OUT
  Bottom 0.254: U$7.25 72.65,32.25 72.65,33.3 75.95,36.7 v78.1,36.7
SCK
  Top 0.254: 48.59,45.75 SV1.23 48.59,47.39 49.55,48.35 53.75,48.35 59.35,53.95 62.3,53.95 63.25,54.9 63.25,68.5 69.92,75.17 SV3.16
  Bottom 0.254: 50.6,57.6 50.6,57.8 44.9,63.5 X5.36
  Bottom 0.305: 50.6,57.6 50.6,50.9 48.59,48.89 SV1.23
SCL_3V3  (via drill 0.6)
  Top 0.254: 34.9,75.2 30.15,70.45 30.15,59.5 30.9,58.75 v31.8,58.75 | v34.8,76.8 34.8,75.2 34.9,75.2 | v36.6,82.7 38.7,84.8 38.7,87.15 38.15,87.7 34,87.7 v33.65,87.35 | v70.45,47.85 70.45,48.85 73.25,51.65 73.25,61.6 74.12,62.47 SV3.6 | 34.9,75.2 41.25,75.2 53.85,87.8 70.15,87.8 72.2,85.8 76.75,85.8 v77.05,86.1 78.25,87.3 80.45,87.3 81.3,86.45 81.3,82.95 79.65,81.3 72.75,81.3 v71.75,80.3 | v33.3,54.7 33.3,54.2 36,51.5 SCL.TP
  Bottom 0.254: 30.2,57.7 R6.1 30.55,58.25 31.8,58.25 | 76.9,86.75 76.5,86.35 U$1.5 | v34.8,76.8 34.8,80.9 v36.6,82.7 | v33.65,87.35 34.3,87.9 U$8.7 | v70.45,47.85 69.85,47.85 | SV3.6 75.6,64.15 75.6,72.35 71.35,76.6 71.35,79.75 71.8,80.2 v71.75,80.3 | U$6.12 34.08,57.67 33.5,58.25 31.8,58.25 | v31.8,58.75 31.8,58.25 | R10.2 76.9,86.75 | 76.9,86.75 77.4,86.25 v77.05,86.1
  Bottom 0.305: U$5.6 70.23,50.98 R1.1 69.85,47.85 69.85,46.17 SV1.5 | U$6.12 34.08,55.58 v33.3,54.7
SDA_3V3  (via drill 0.6)
  Top 0.254: v78.45,84.75 78.25,84.55 71.65,84.55 69.45,86.7 54.45,86.7 39.05,71.3 34.8,71.3 33.45,69.95 v33.45,68.7 33.45,62.4 v31.7,60.65 | 80.95,61.2 80.95,56.55 79.2,54.8 79.2,53.85 77.4,52.05 77.4,50.6 73.99,47.19 SV1.3 | 80.95,61.2 78.55,61.2 SV3.4 | SDA.TP 32.2,50 32.1,50.1 32.1,52.85 31.05,53.9 31.05,55.45 32.05,56.45 34.8,56.45 35.35,55.9 v35.35,54.65 | 80.95,61.2 83.7,63.95 83.7,89.75 83.25,90.2 81.89,90.2 v80.3,88.61
  Bottom 0.254: U$6.11 34.73,57.77 32.7,59.8 31.7,59.8 | 31.7,59.8 R2.1 | v31.7,60.65 31.7,59.8 | U$1.6 78.3,84.6 v78.45,84.75 78.45,86.45 79.2,87.2 79.6,87.2 80.3,87.9 v80.3,88.61 80.54,88.4 R9.2 | v33.45,68.7 33.45,81.7 31.45,83.7 31.45,85.8 32.6,87.05 32.6,87.9 33.2,88.4 U$8.8 | R3.1 71.25,49.05 72.1,48.2 72.1,46.46 SV1.3
  Bottom 0.305: U$5.5 71.5,50.01 R3.1 | U$6.11 34.73,55.27 v35.35,54.65
STEPUP_ENABLE
  Bottom 0.254: U$2.1 26.85,78.95 25.5,78.95 25.1,79.35 25.1,81.3 24.4,81.95 22,81.95 21.5,81.45 21.5,47.2 22.6,46.1 31.6,46.1 32.1,45.6
  Bottom 0.305: SV1.31 39.7,43.3 39.7,41.35 39.05,40.7 35.3,40.7 34.6,41.4 34.6,42.7 34.05,43.25 32.65,43.25 32.1,43.8 32.1,45.6
TOUCH_X+
  Bottom 0.254: U$6.2 32.1,62.24 32.1,63.05 32.85,63.8 36.95,63.8 38.2,62.55 C2.2 39.45,61 40.8,61 41.8,62 X5.39
TOUCH_X-
  Bottom 0.254: U$6.4 33.45,62.19 33.45,61.2 33.85,60.8 35.25,60.8 36.65,59.4 38.65,59.4 39.7,58.35 C18.2 39.7,58.6 42.1,61 X5.41
TOUCH_Y+
  Bottom 0.254: U$6.3 32.77,60.38 35.9,57.25 37.05,57.25 37.6,57.8 38.5,57.8 | C3.2 38.5,57.8 | 38.5,57.8 40.2,57.8 42.9,60.5 X5.42
TOUCH_Y-
  Bottom 0.254: U$6.5 34.08,61.52 34.3,61.3 36.1,61.3 36.3,61.1 38.4,61.1 C4.2 40.65,60.2 41.95,61.5 X5.40
UART_RX
  Top 0.254: SV3.3 78.5,58.61 78.5,56.8 75.85,54.15 75.85,51.35 70.95,46.45 68.85,46.45 67.7,45.3 67.7,44.15 66.37,42.82 SV1.10
UART_TX
  Top 0.254: SV1.8 68.91,42.81 70.15,44.05 70.15,45.25 70.8,45.9 71.55,45.9 76.55,50.9 76.55,53 78,54.45 78,55.57 SV3.1
V+  (via drill 0.6)
  Top 0.254: VCC.TP 49.55,51.55 52.95,51.55 v53.7,50.8
  Bottom 0.254: 56.21,45.44 SV1.17 | v53.7,50.8 53.5,50.6 R5.2
  Bottom 0.305: 56.21,45.44 55,46.65 53.35,46.65 52.4,47.6 52.4,49.6 52.75,49.95 R5.2
  Bottom 0.406: R5.2 R4.2 57.16,51.6 IC2.8
V_SYNC
  Bottom 0.254: X5.10 39.15,76.5 R14.1
VBAT+
  Bottom 0.61: U$5.3 70.23,61.88 U$4.+
VBUS
  Bottom 0.254: U$1.24 73.25,83.85 | U$1.1 74.4,84.55
  Bottom 0.406: C16.1 71.05,87.65 | U$9.1_+5V 72.7,91.1 72.35,90.75 | 72.55,84.55 72.55,84.85 | 74.4,84.55 72.55,84.55 | 73.25,83.85 72.55,84.55
  Bottom 0.61: 71,89.4 JUMPER.1
  Bottom 0.813: 72.35,90.75 71,89.4 C16.1 | 71.05,87.65 72.55,86.15 72.55,84.85
VCC
  Bottom 0.254: SV1.1 75.2,45.9 74.1,45.9 72.95,47.05 R3.2 74.25,49.6 75.35,50.7 75.35,51.6 74.5,52.45 73.9,52.45 73.25,53.15 73.25,55.35 72.75,55.8 68.6,55.8 67.7,54.9 67.7,54.4
  Bottom 0.305: 73,49.7 R3.2 | C1.1 67.91,50.76 R1.2 | 67.7,54.4 U$5.8
  Bottom 0.61: R1.2 67.69,51.66 U$5.8
VCC/2
  Bottom 0.254: U$7.38 79.17,31.45 79.2,31.45 79.55,31.1 78.98,30.53 U$7.39

### Text on the board
tPlace: CrackberryPi / v1.0.4
bPlace: CrackberryPi / v1.0.4
tNames: 20.5,0
bNames: SFH482 | 30R | LED | ZLDO / 1117 / G33TA | 30R | uUSB-B | 10K | 1K | CM322522 / 8.2uH | 3x 4.7uF | BC847 | 4.7uF | BQ24297 | 4.7uF | 4.7uF | 3x 10K | 317R | CM322522 8.2uH | BAT54W | 47pF | 1.3M | NCP1406 | 10K | 4.7uF | 5x 10K | 110K | 10mF | 470pF | 30R | BZT52B12 / 12V Zener | 0.1uF | BAT-HLD-012 / CR1216 | 609-1202-1-ND / ZIF-50 | 2x MAX2650 | TSC2007 | 4x 0.1uF | 470pF | 10K | 10K | MCP7940 | CM200C / 32.768kHz | 0.1uF | 0.1uF | CAT24C32 | 6x 147R | IRLML5203 / MOSFET | 1uF | 10K | TSOP38238 | 10K | 10K | 45K | 2x 3.9K | 0.1uF | TCA8424 | 10uF